# Altium schematic sheet JETSON.SchDoc
size E; SheetNumber: 4; SheetTotal: 10
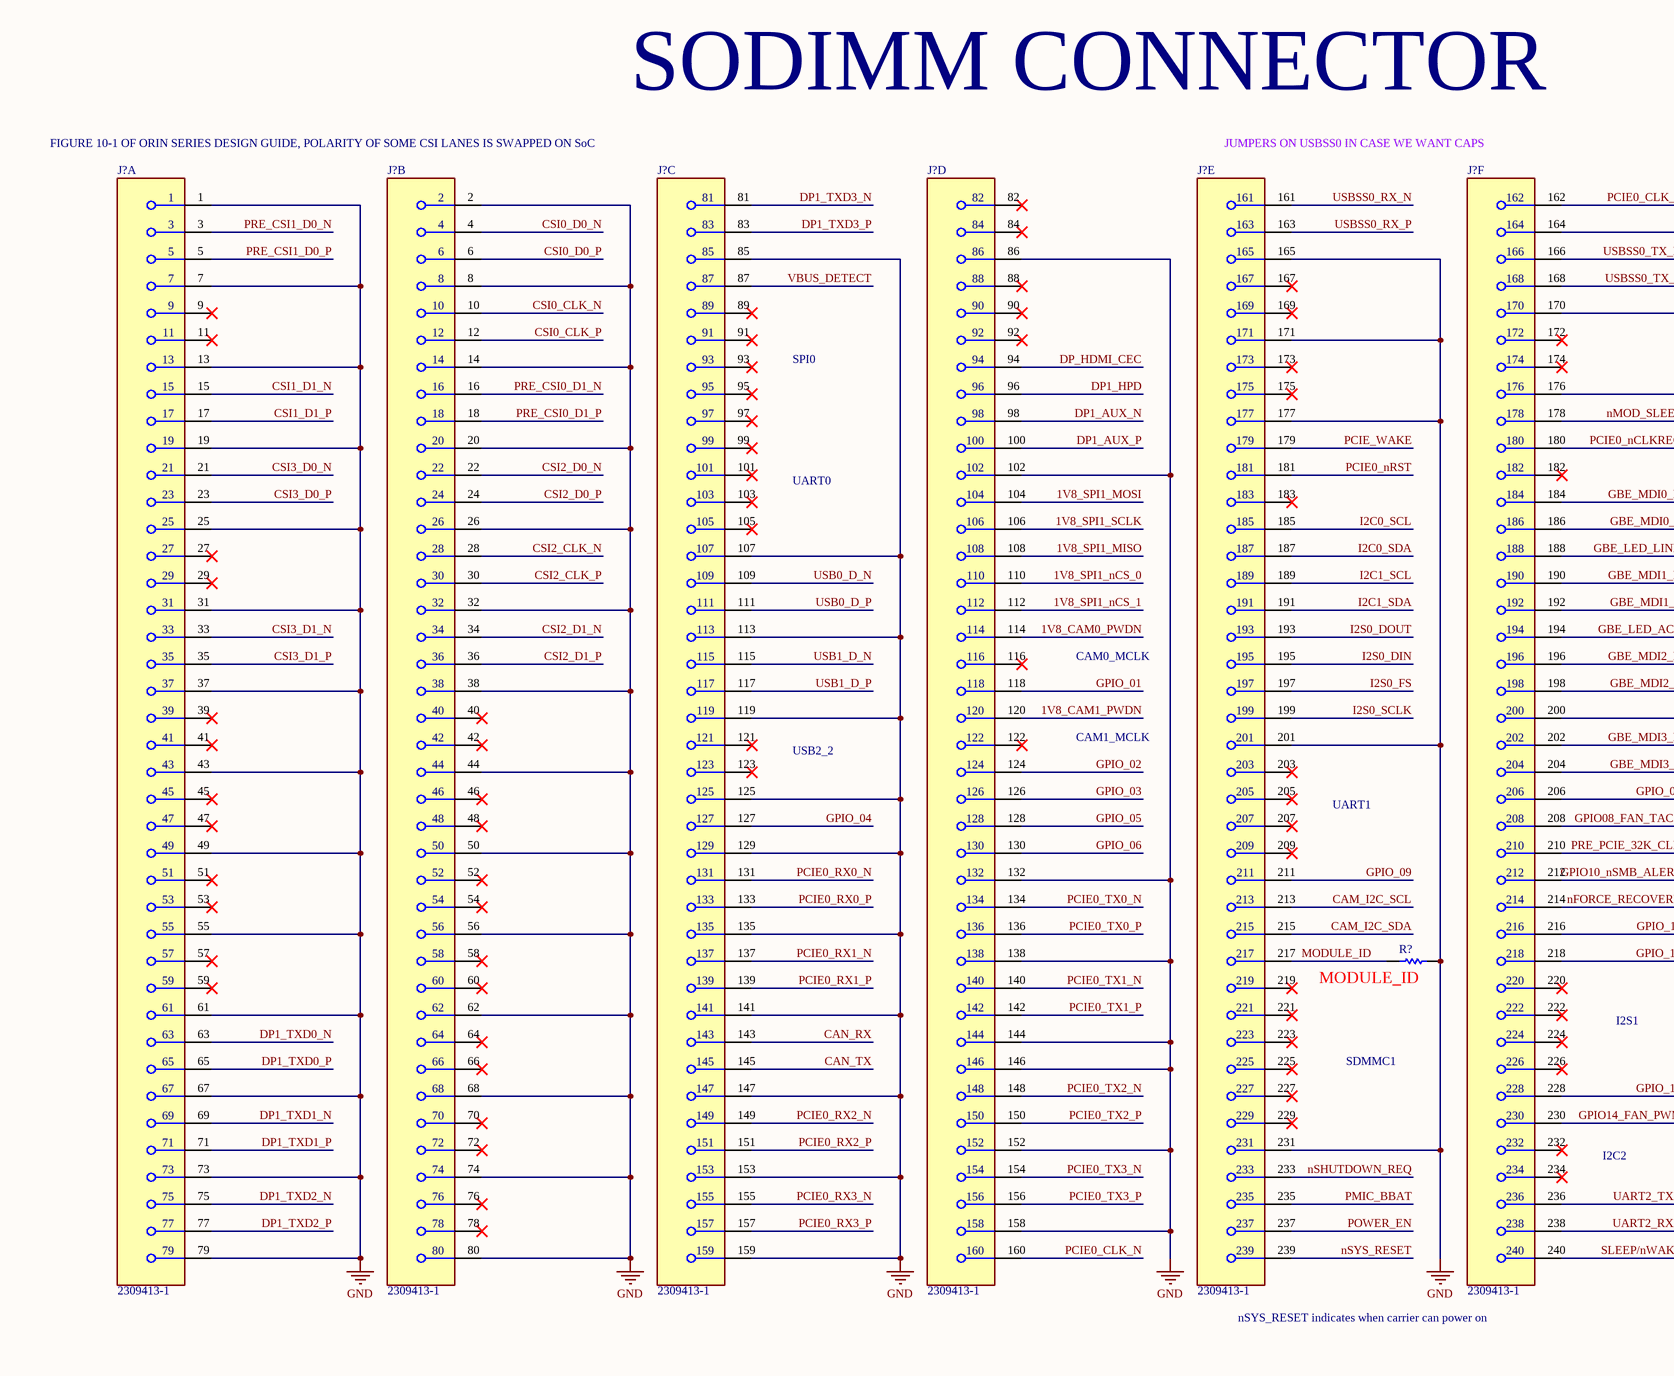
[diagram p0: JETSON.SchDoc, top left]
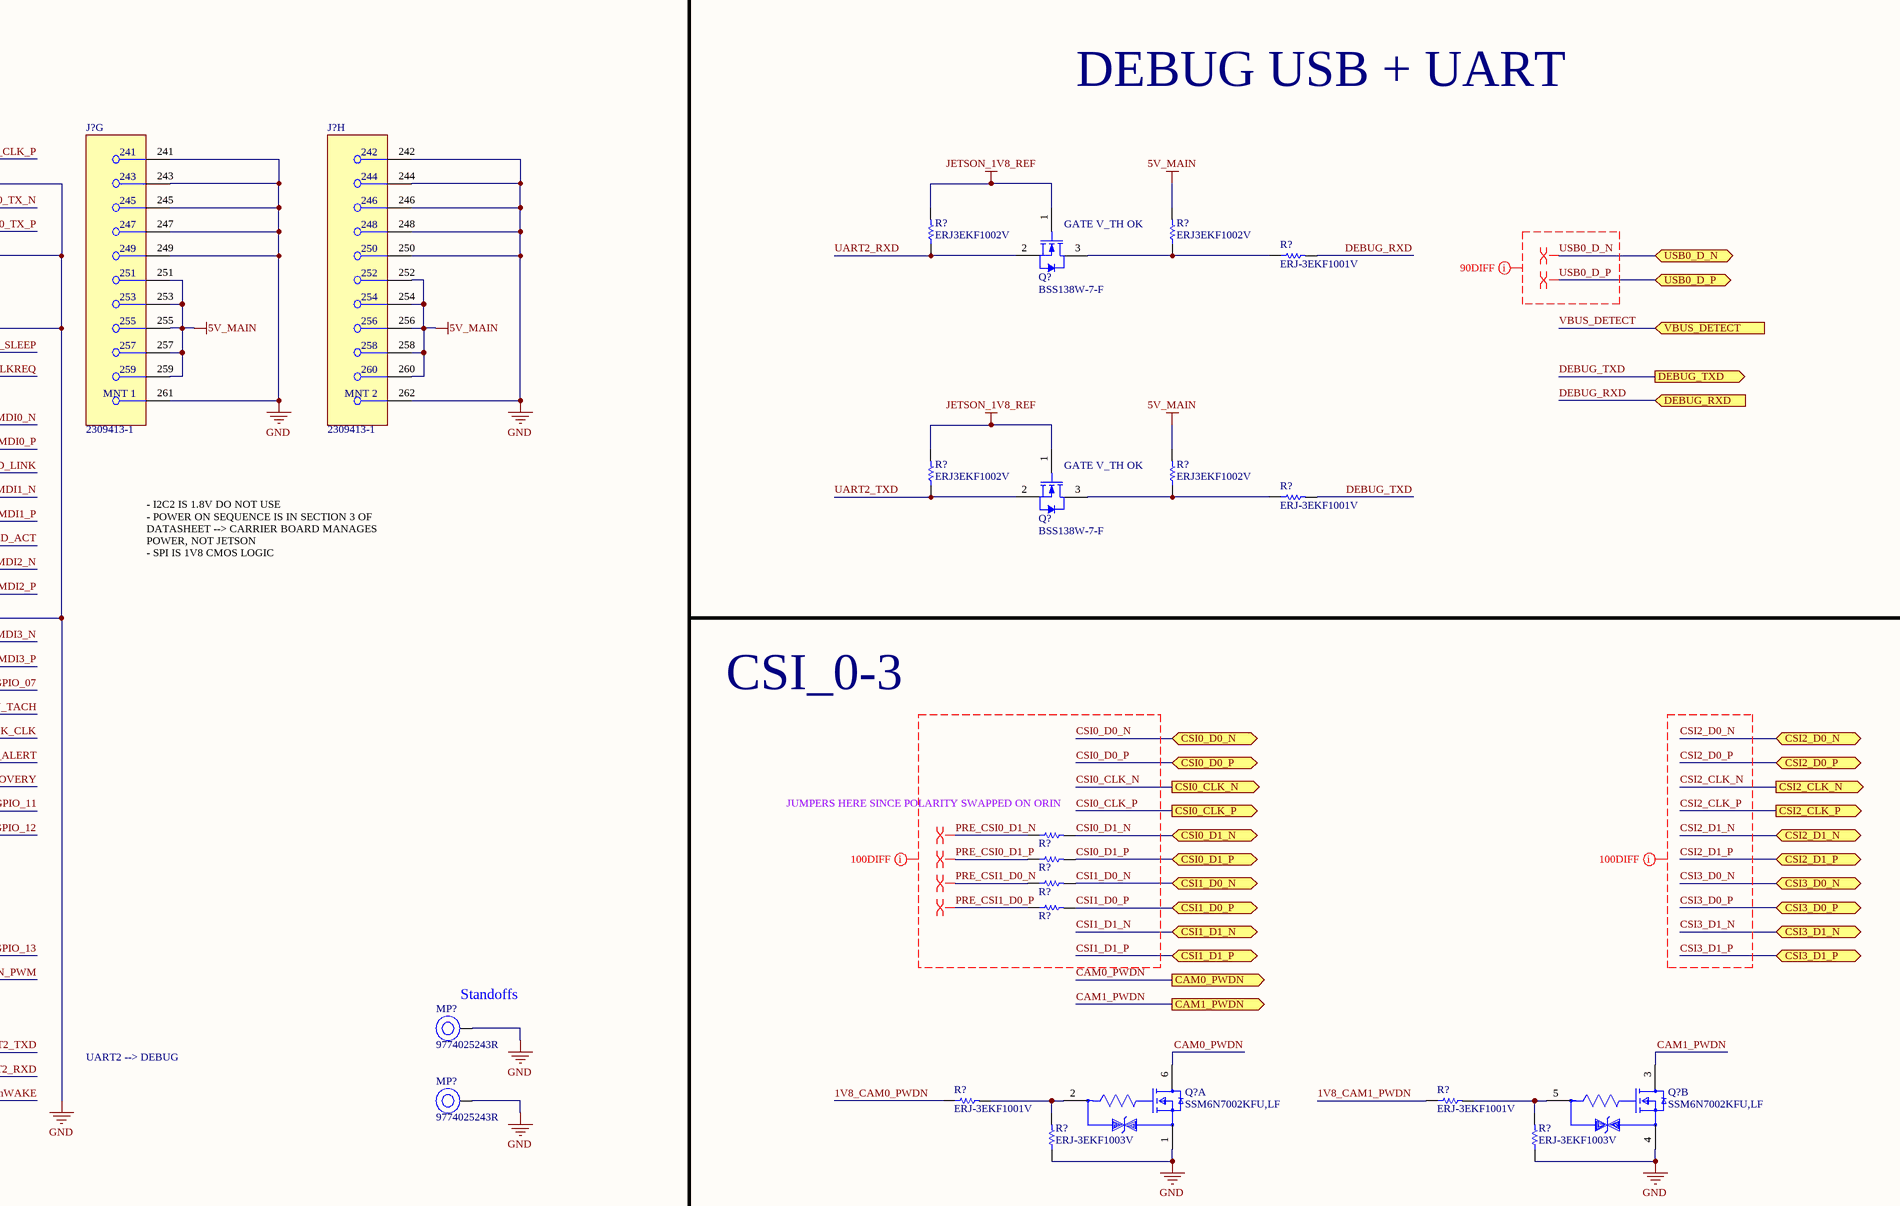
[diagram p1: JETSON.SchDoc, top middle]
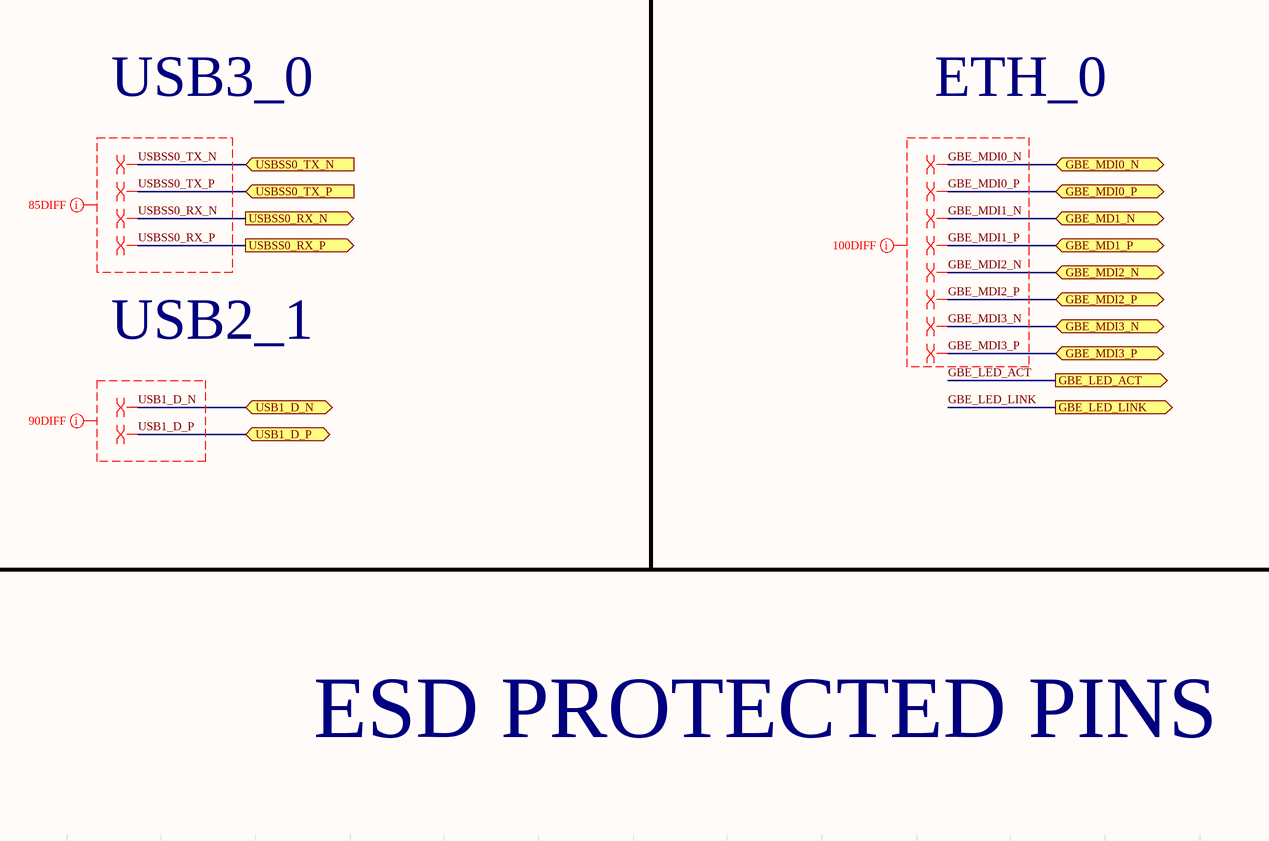
[diagram p2: JETSON.SchDoc, top right]
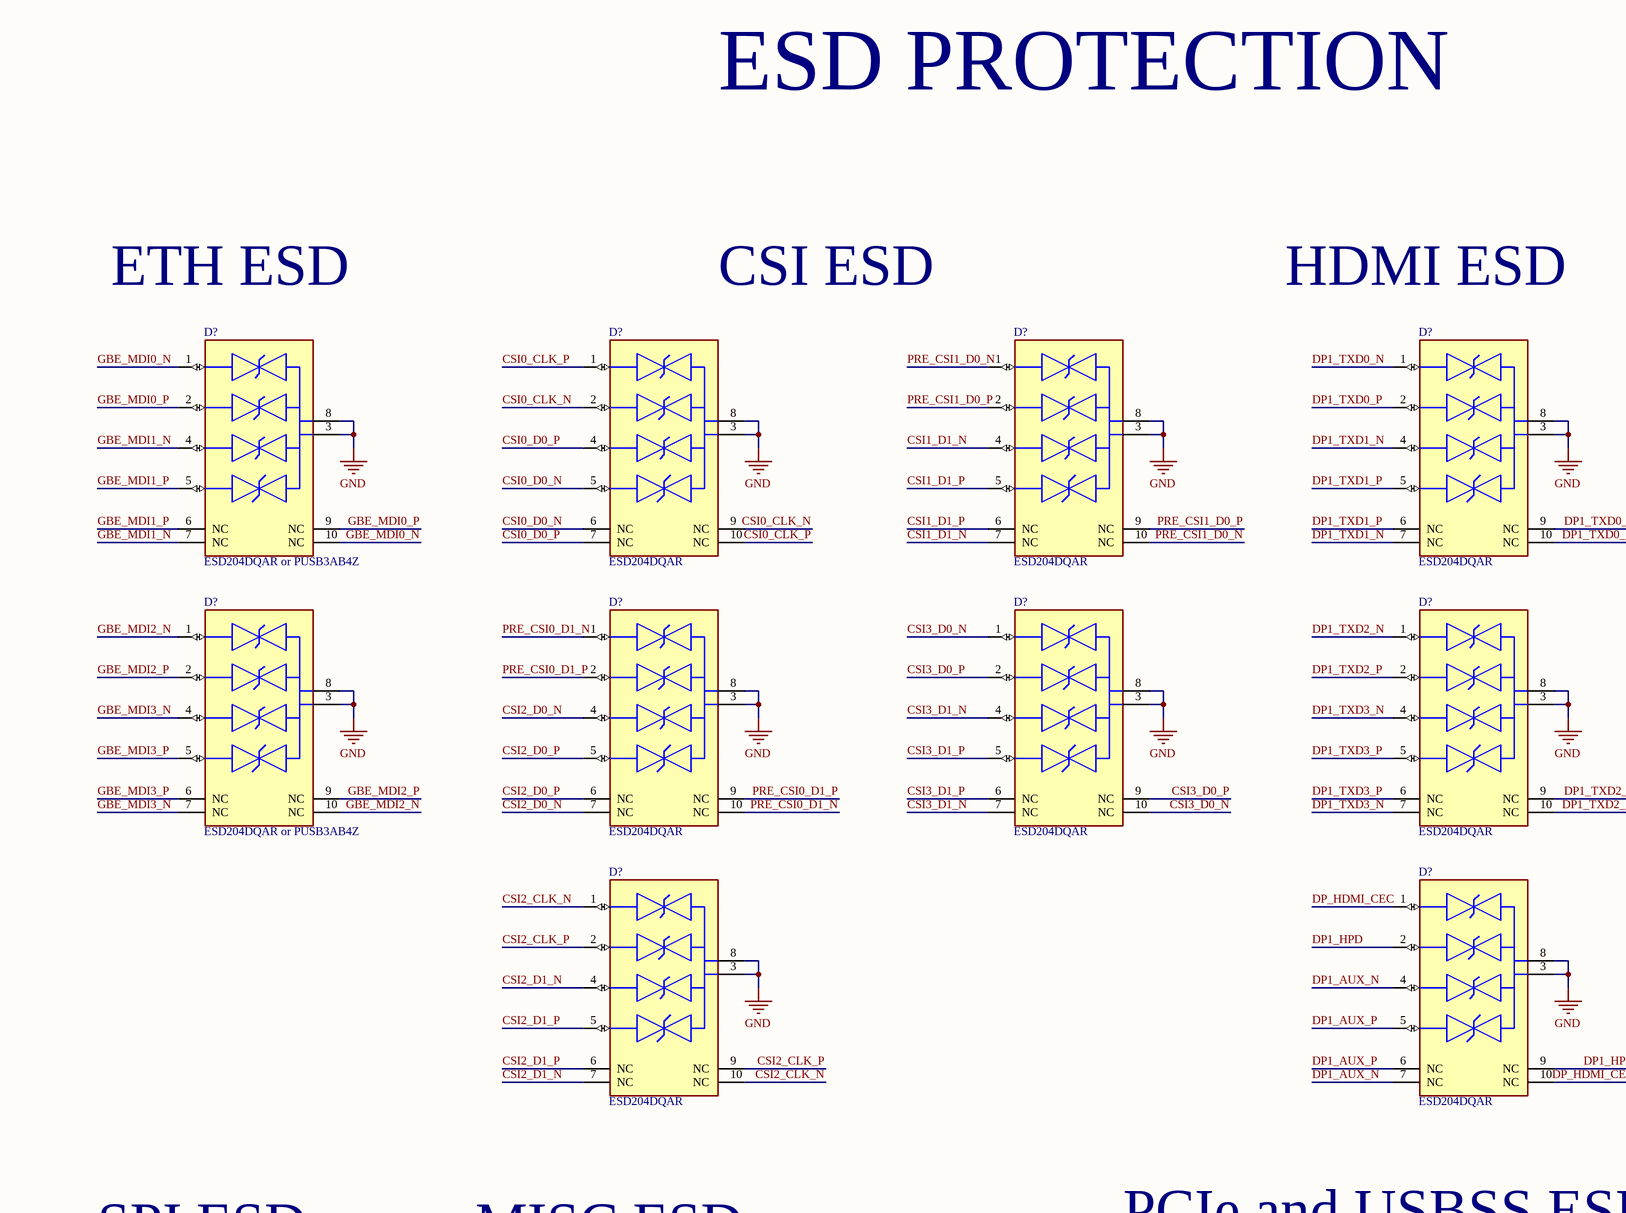
[diagram p3: JETSON.SchDoc, centre left]
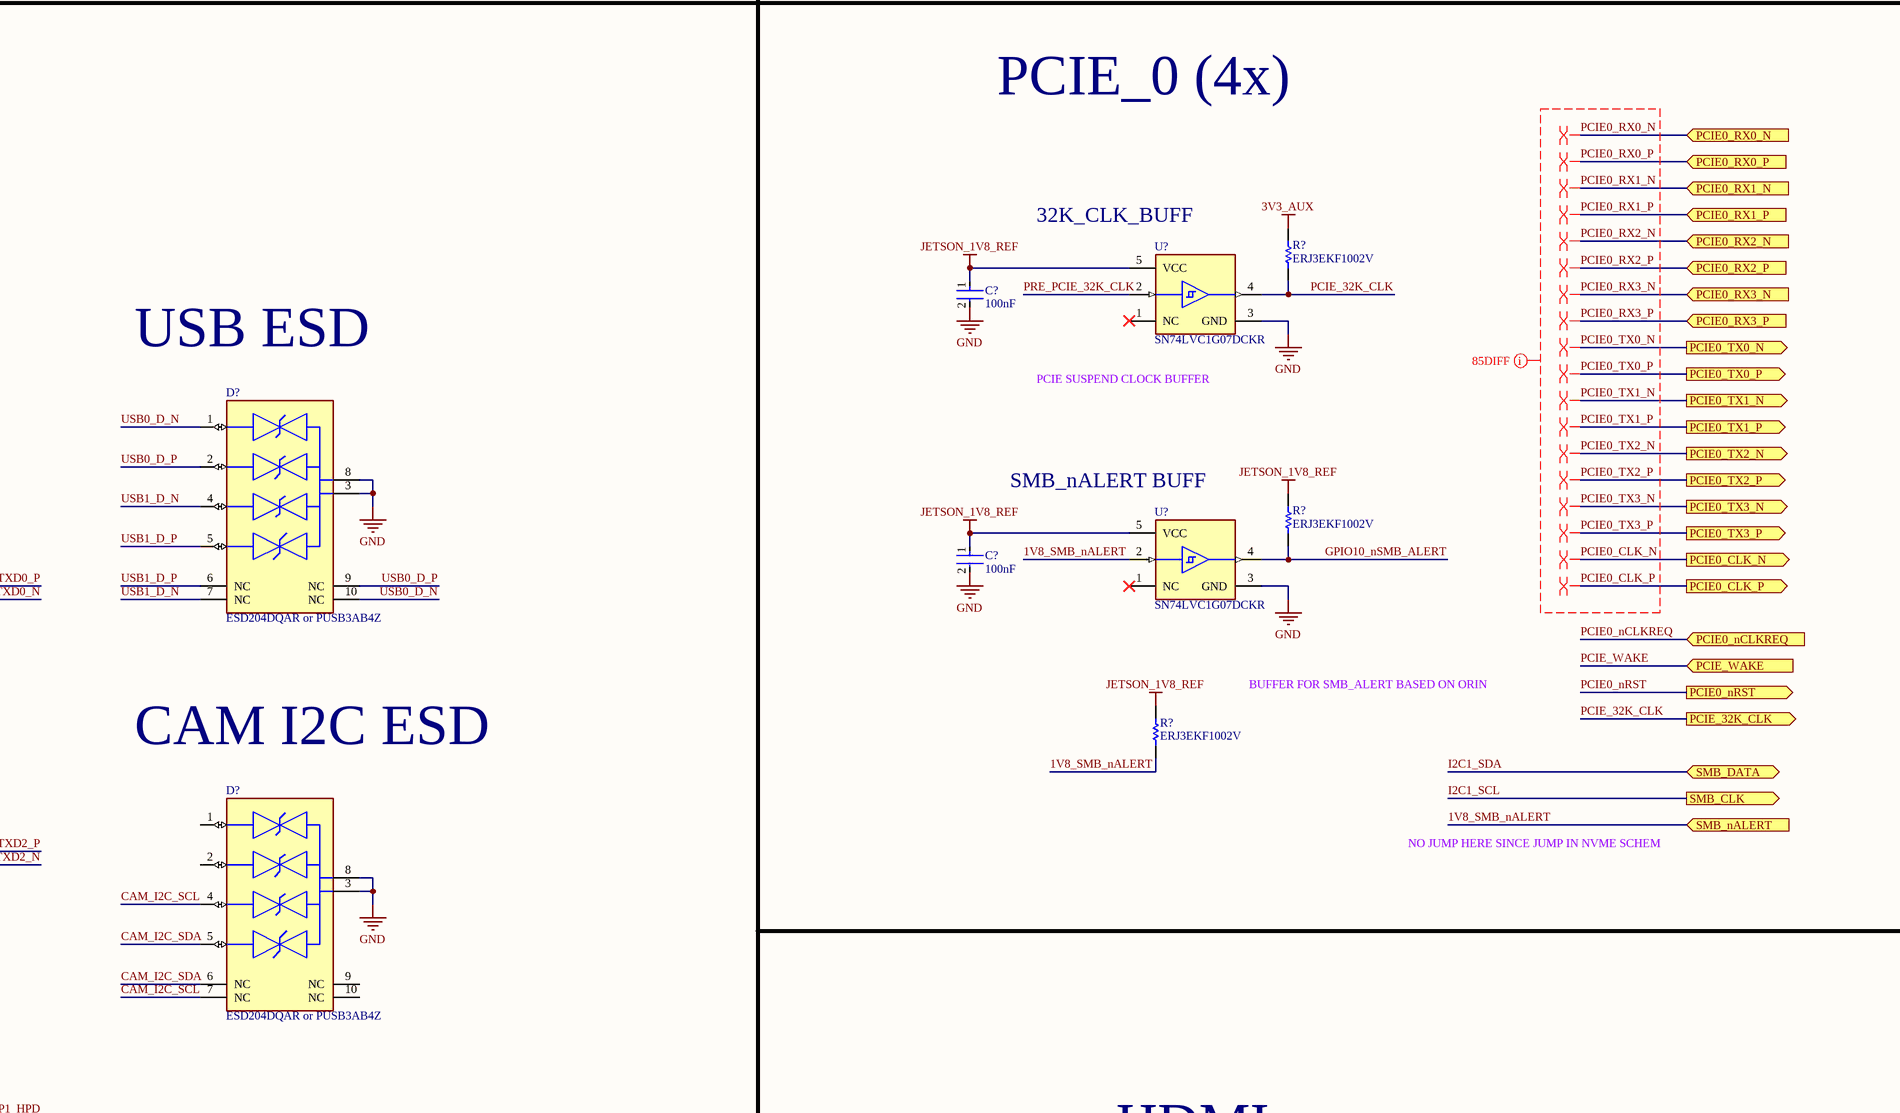
[diagram p4: JETSON.SchDoc, centre middle]
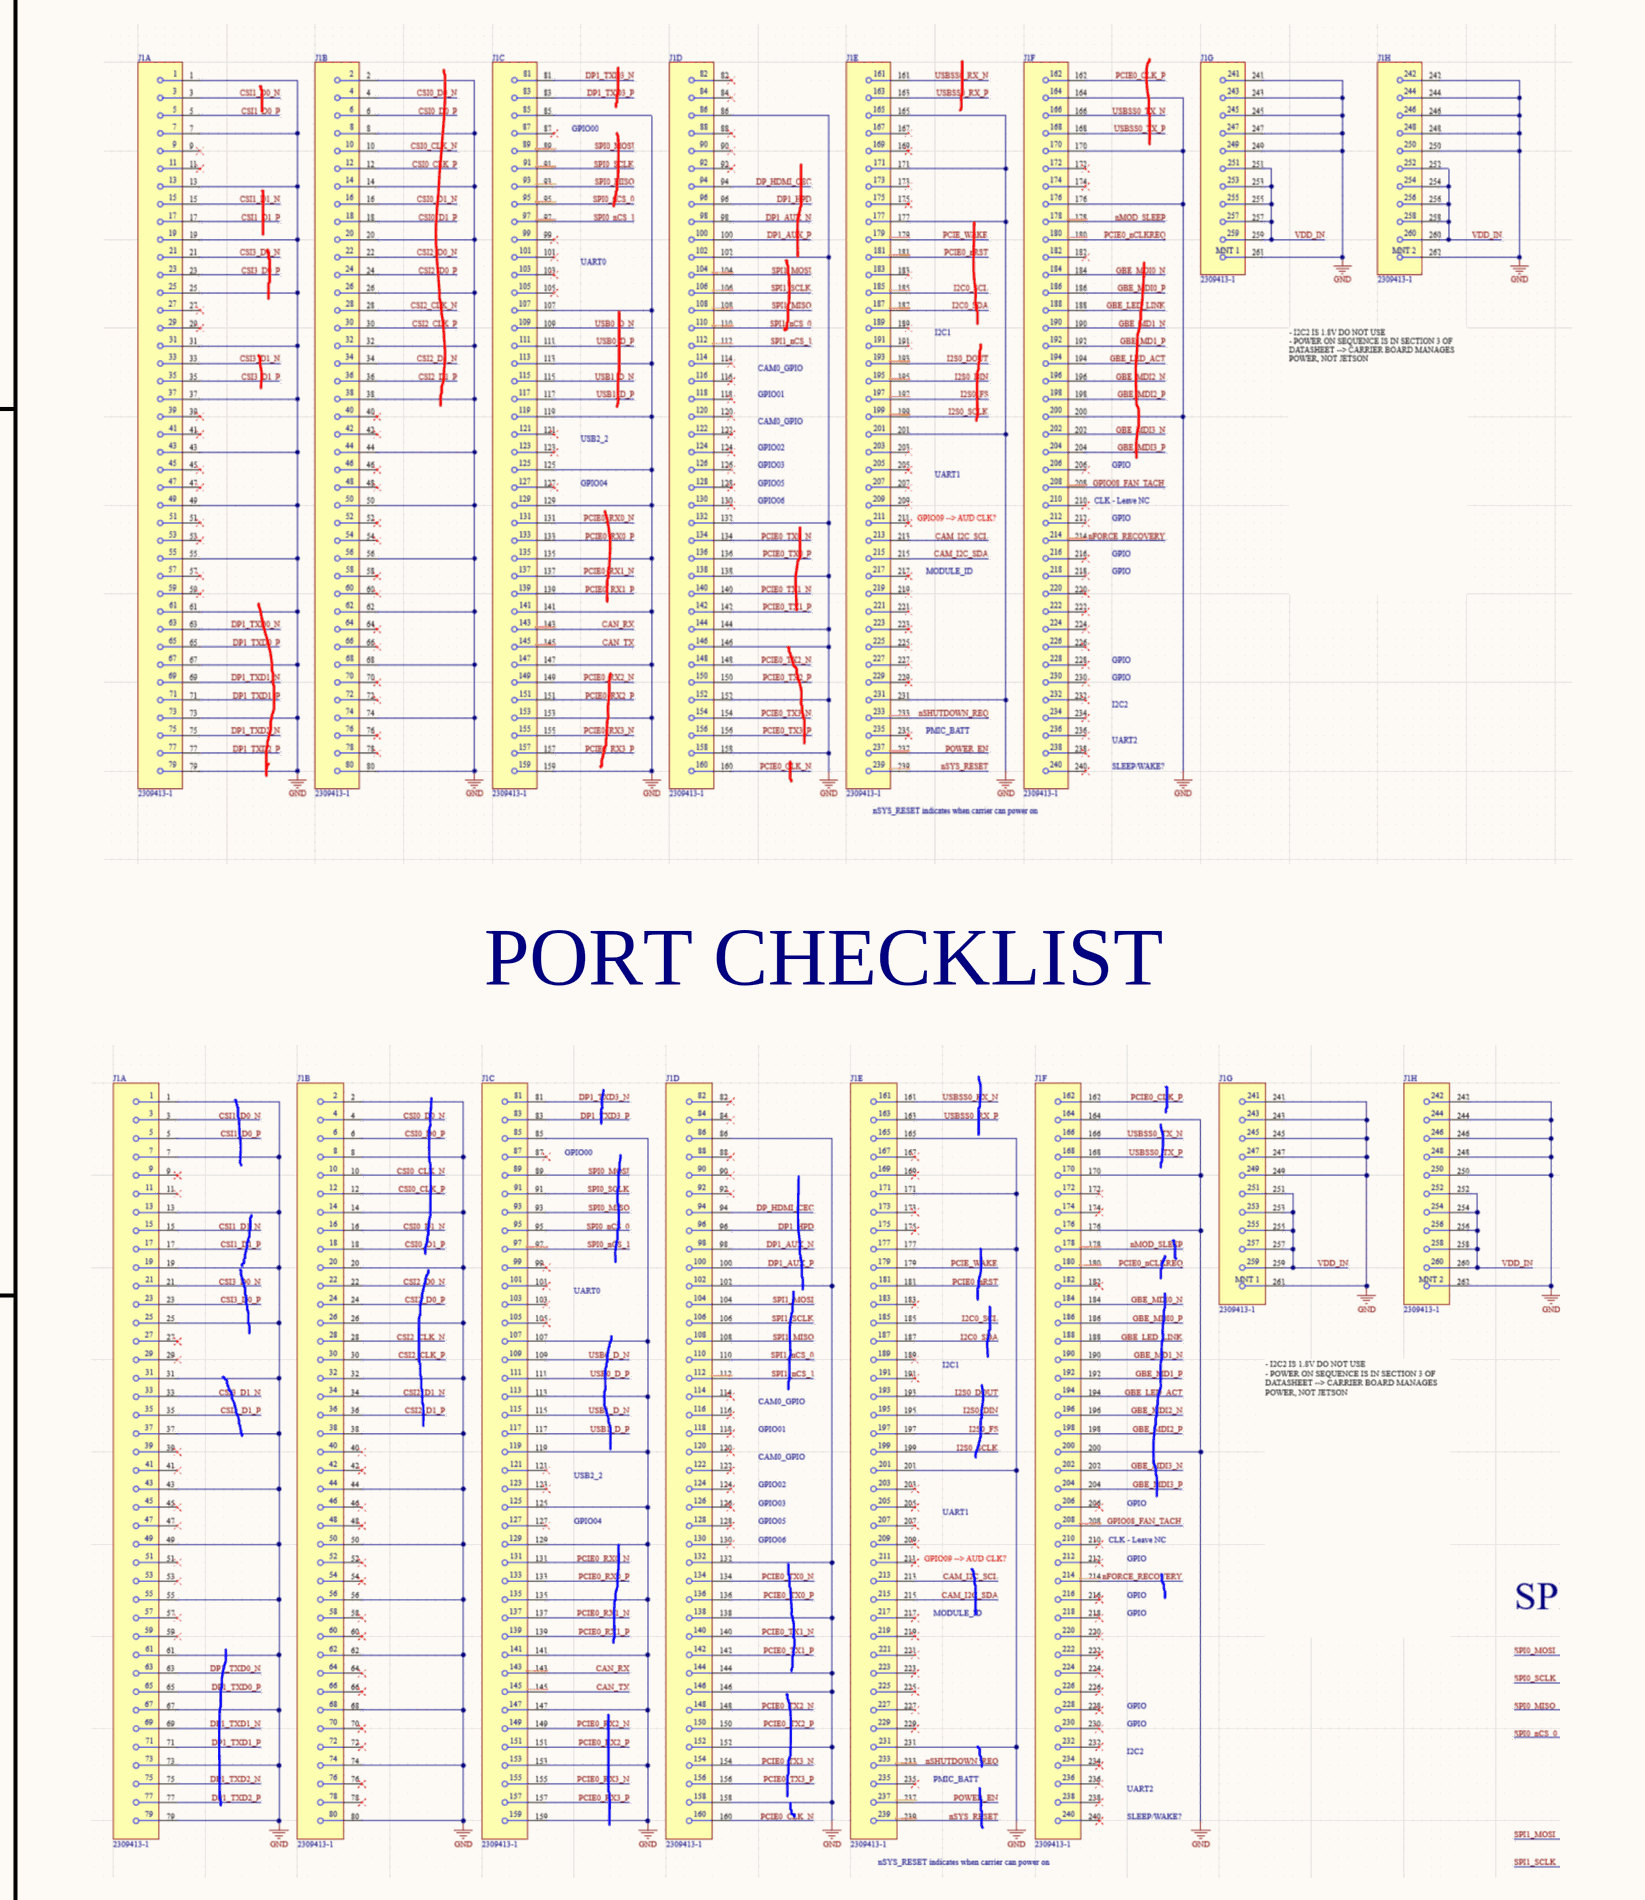
[diagram p5: JETSON.SchDoc, centre right]
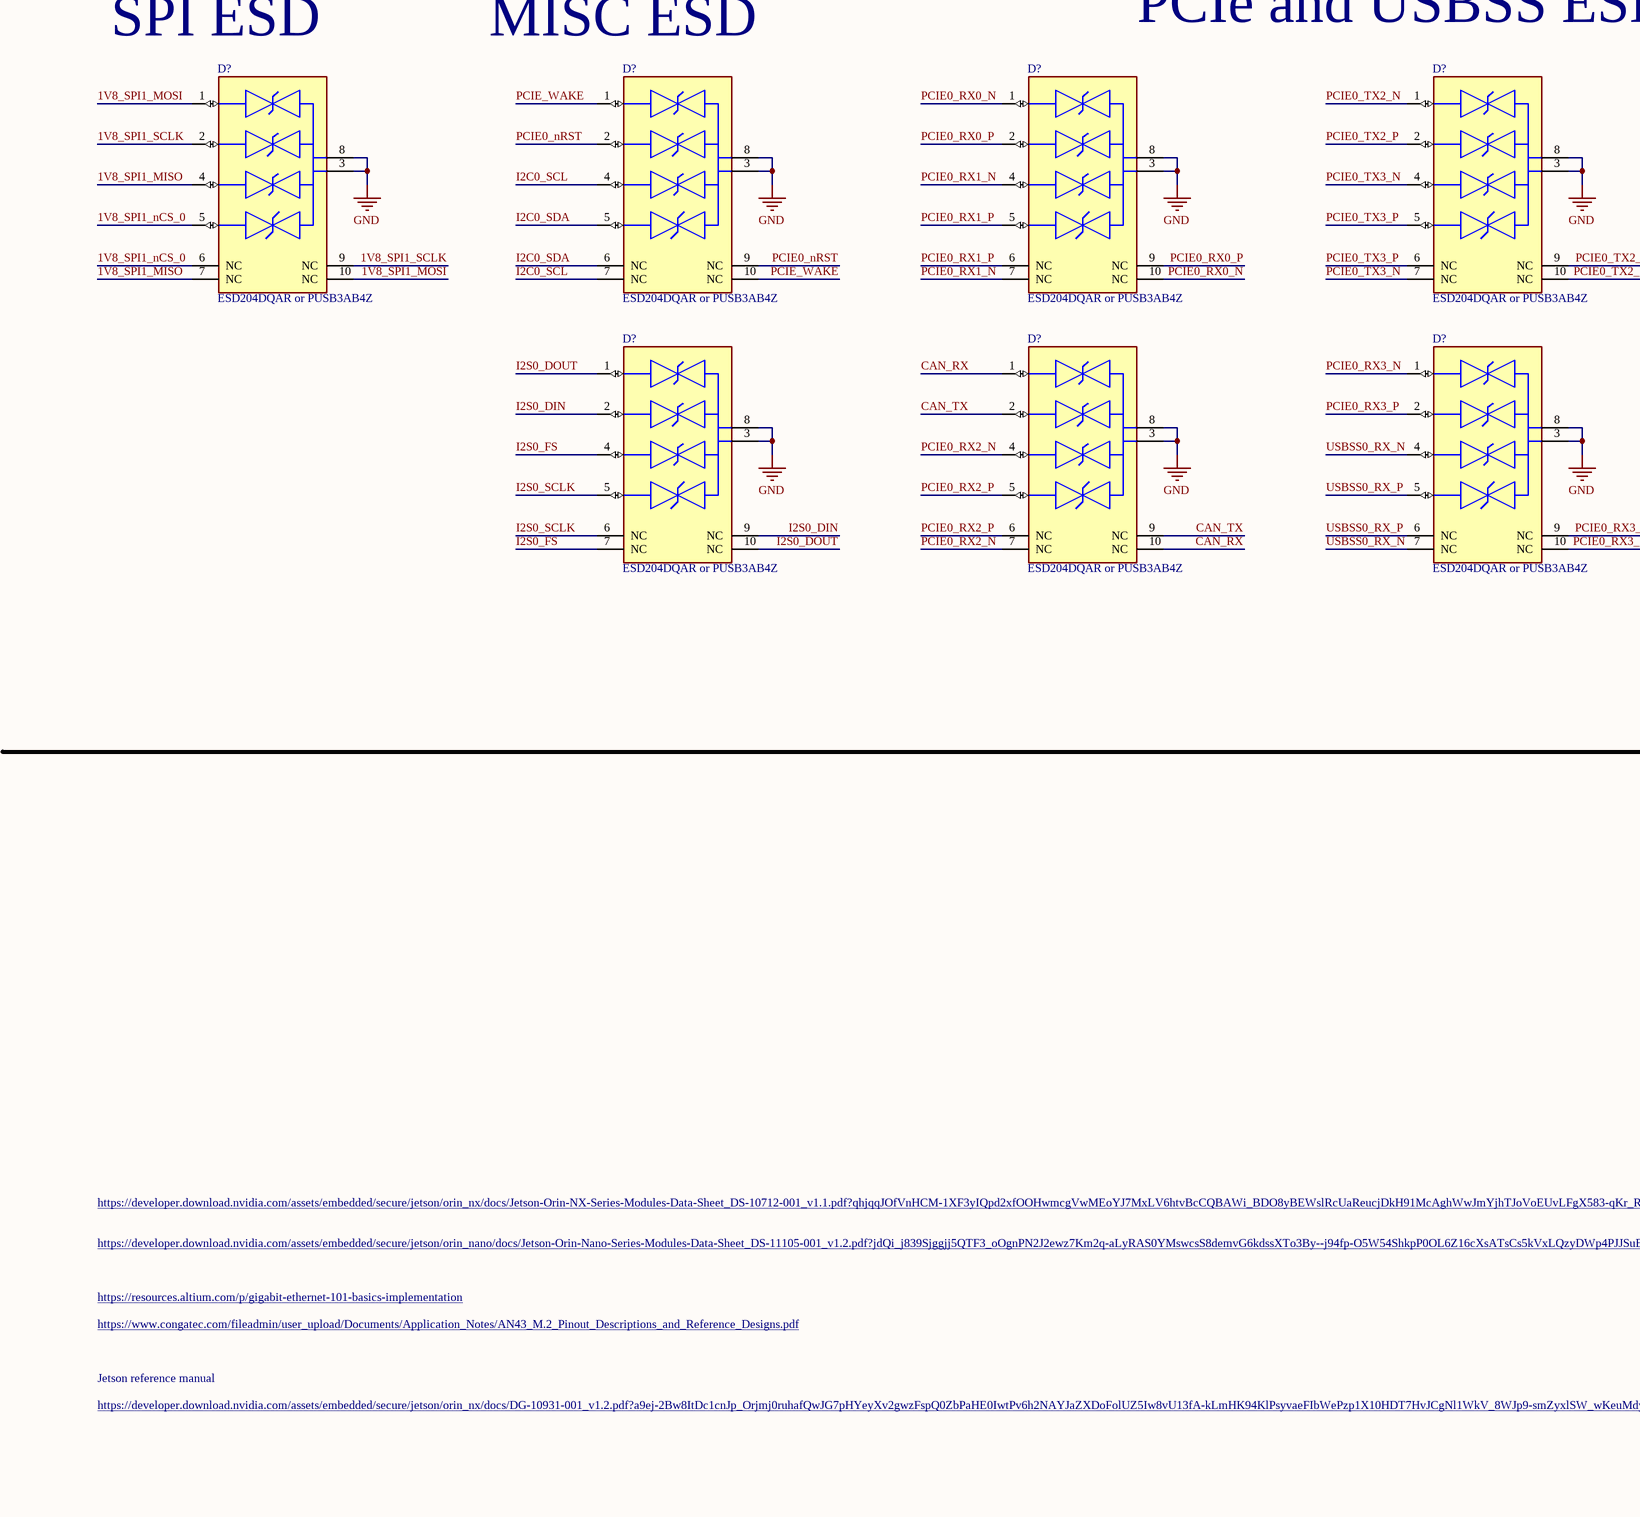
[diagram p6: JETSON.SchDoc, bottom left]
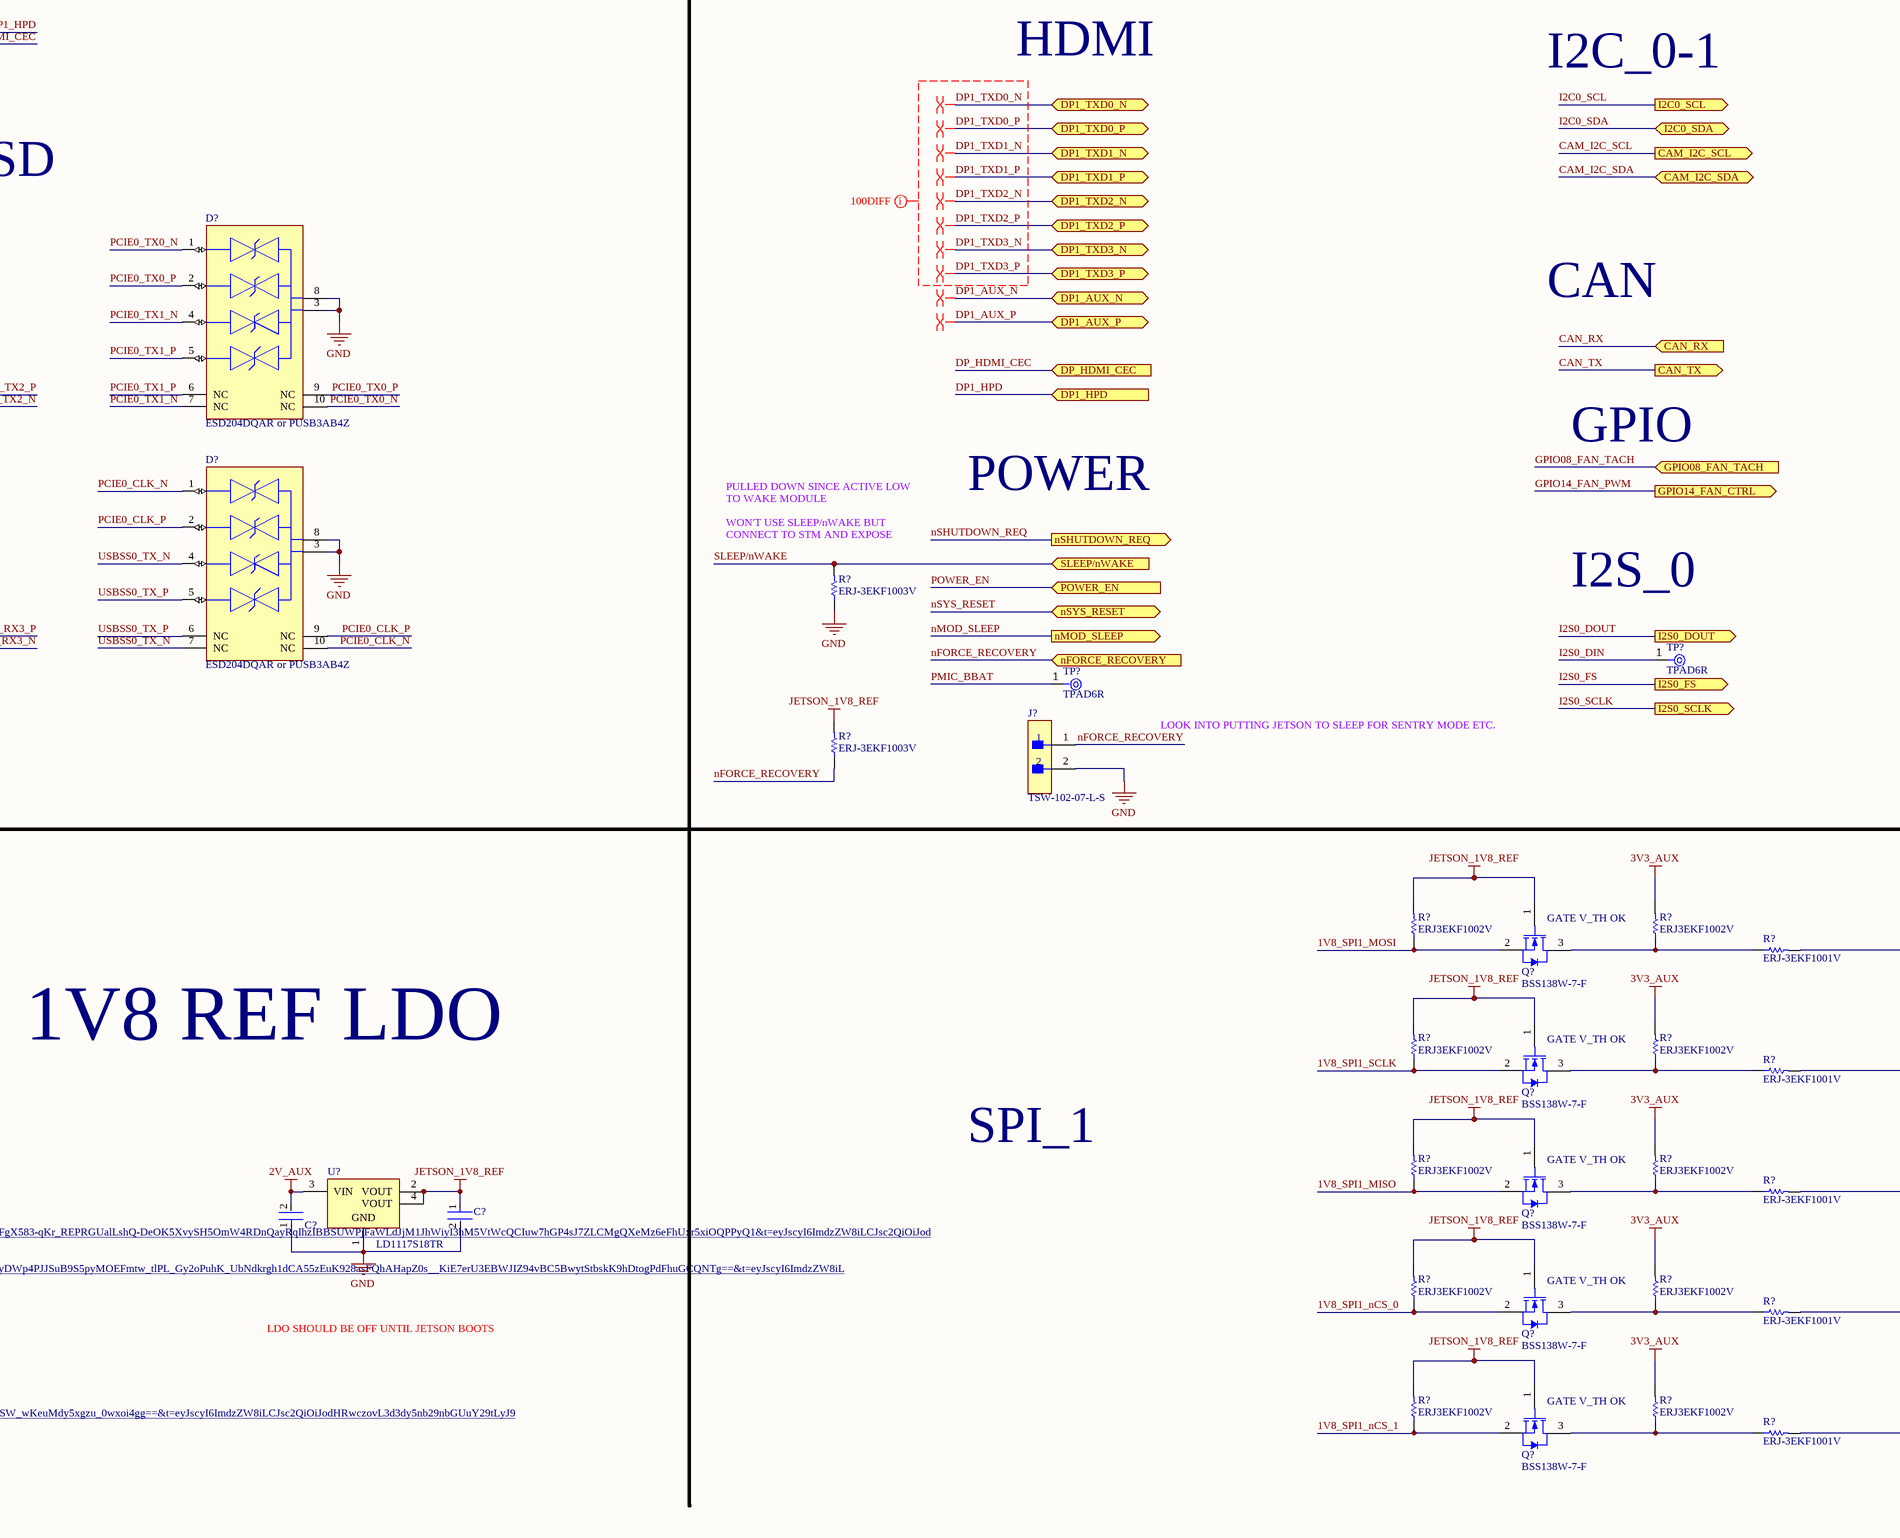
[diagram p7: JETSON.SchDoc, bottom middle]
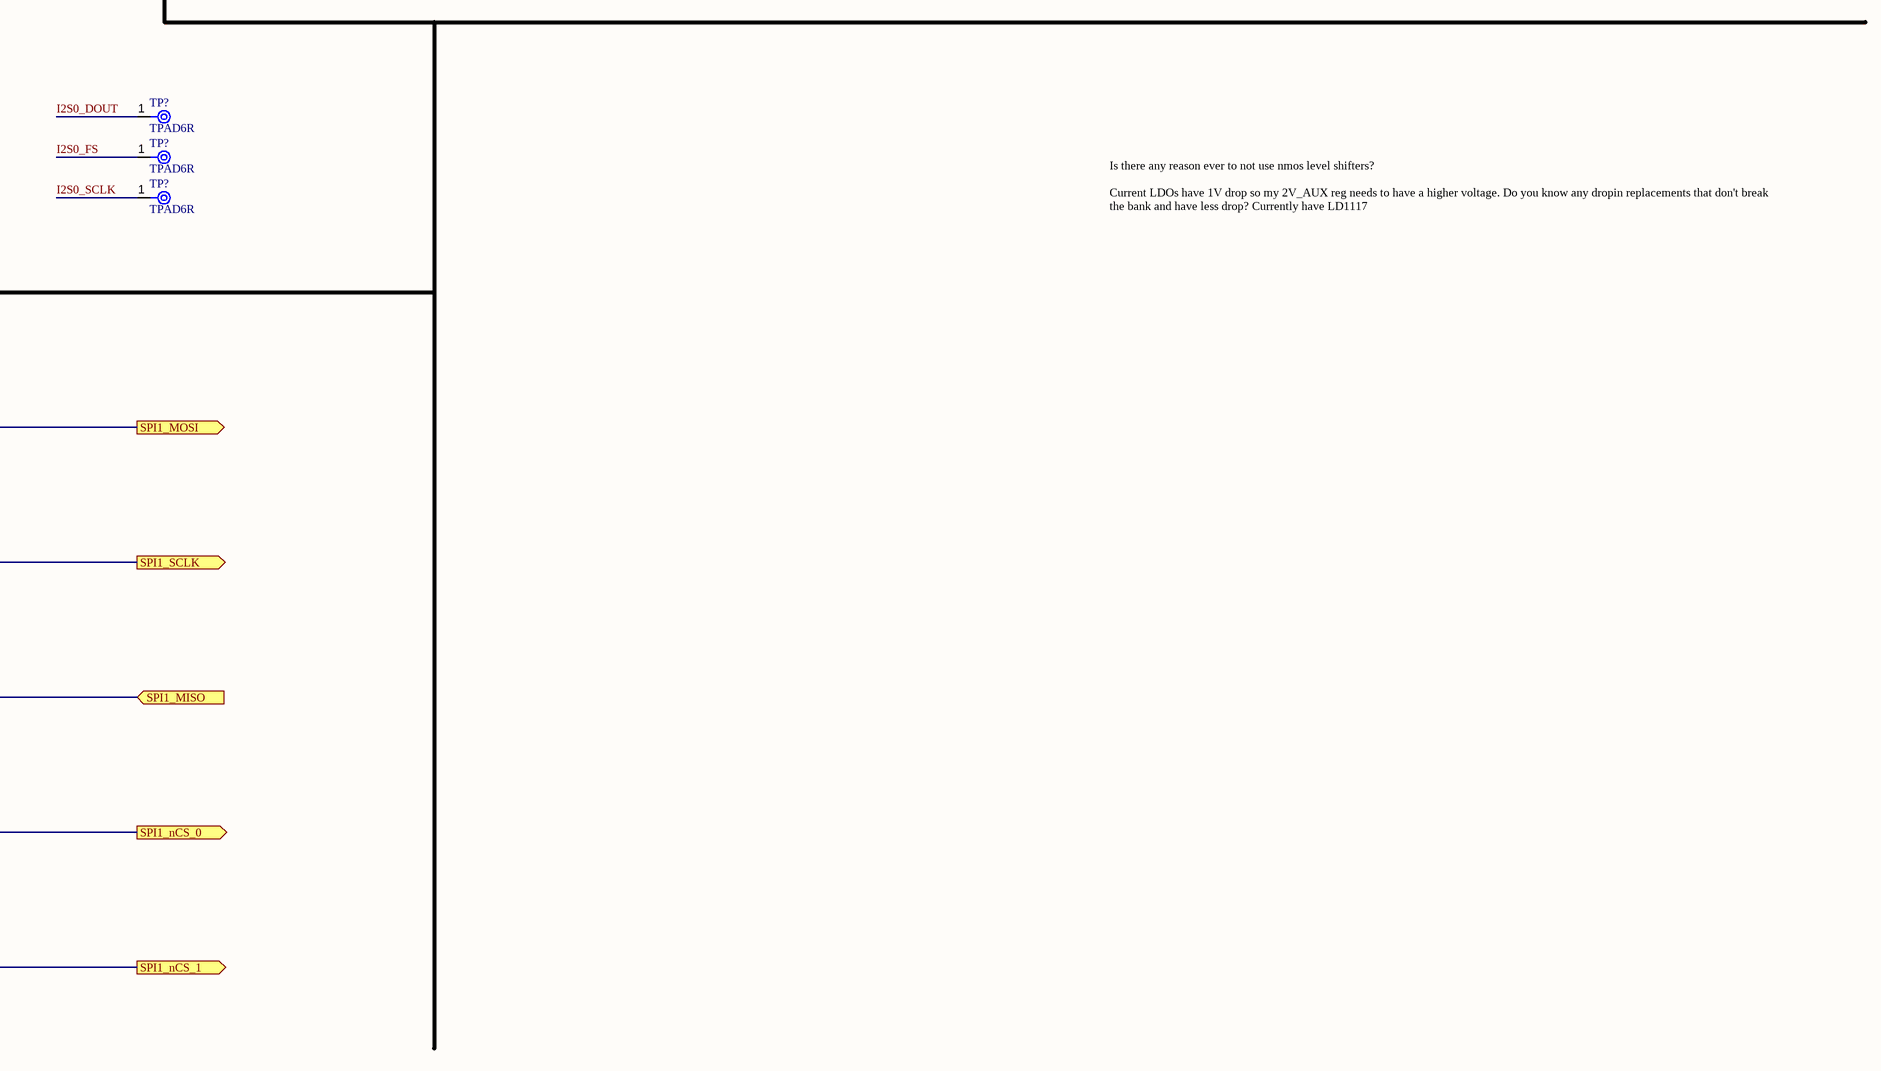
[diagram p8: JETSON.SchDoc, bottom right]

## Parts
(Parts that share a designator on the sheet are numbered #1, #2 ... from top to bottom, then left to right.)
C?#1  100nF  [FP-0402-L_1_0_0_05-W_0_5-IPC_A]
C?#2  100nF  [FP-0402-L_1_0_0_05-W_0_5-IPC_A]
C?#3  GRM188R60J106ME47D  [FP-GRM188-0_1-e0_2_0_55-IPC_A]  (value not drawn)
C?#4  C1005X7R1H104K050BB  [FP-C1005-050-0_05-IPC_C]  (value not drawn)
D?#1  ESD204DQAR or PUSB3AB4Z  [FP-DQA0010A-MFG]
D?#2  ESD204DQAR  [FP-DQA0010A-MFG]
D?#3  ESD204DQAR  [FP-DQA0010A-MFG]
D?#4  ESD204DQAR  [FP-DQA0010A-MFG]
D?#5  ESD204DQAR or PUSB3AB4Z  [FP-DQA0010A-MFG]
D?#6  ESD204DQAR or PUSB3AB4Z  [FP-DQA0010A-MFG]
D?#7  ESD204DQAR  [FP-DQA0010A-MFG]
D?#8  ESD204DQAR  [FP-DQA0010A-MFG]
D?#9  ESD204DQAR  [FP-DQA0010A-MFG]
D?#10  ESD204DQAR or PUSB3AB4Z  [FP-DQA0010A-MFG]
D?#11  ESD204DQAR  [FP-DQA0010A-MFG]
D?#12  ESD204DQAR  [FP-DQA0010A-MFG]
D?#13  ESD204DQAR or PUSB3AB4Z  [FP-DQA0010A-MFG]
D?#14  ESD204DQAR or PUSB3AB4Z  [FP-DQA0010A-MFG]
D?#15  ESD204DQAR or PUSB3AB4Z  [FP-DQA0010A-MFG]
D?#16  ESD204DQAR or PUSB3AB4Z  [FP-DQA0010A-MFG]
D?#17  ESD204DQAR or PUSB3AB4Z  [FP-DQA0010A-MFG]
D?#18  ESD204DQAR or PUSB3AB4Z  [FP-DQA0010A-MFG]
D?#19  ESD204DQAR or PUSB3AB4Z  [FP-DQA0010A-MFG]
D?#20  ESD204DQAR or PUSB3AB4Z  [FP-DQA0010A-MFG]
D?#21  ESD204DQAR or PUSB3AB4Z  [FP-DQA0010A-MFG]
J?#1  2309413-1  [FP-2309413-1-MFG]  (part A of 8)
J?#2  2309413-1  [FP-2309413-1-MFG]  (part B of 8)
J?#3  2309413-1  [FP-2309413-1-MFG]  (part C of 8)
J?#4  2309413-1  [FP-2309413-1-MFG]  (part D of 8)
J?#5  2309413-1  [FP-2309413-1-MFG]  (part E of 8)
J?#6  2309413-1  [FP-2309413-1-MFG]  (part F of 8)
J?#7  2309413-1  [FP-2309413-1-MFG]  (part G of 8)
J?#8  2309413-1  [FP-2309413-1-MFG]  (part H of 8)
J?#9  TSW-102-07-L-S  [FP-TSW-102-07-L-S-MFG]
MP?#1  9774025243R  [9774025243]
MP?#2  9774025243R  [9774025243]
Q?#1  BSS138W-7-F  [DIOD-SOT323-3_V]
Q?#2  BSS138W-7-F  [DIOD-SOT323-3_V]
Q?#3  SSM6N7002KFU,LF  [FP-SSOP6-P-0_65A-MFG]  (part A of 2)
Q?#4  SSM6N7002KFU,LF  [FP-SSOP6-P-0_65A-MFG]  (part B of 2)
Q?#5  BSS138W-7-F  [DIOD-SOT323-3_V]
Q?#6  BSS138W-7-F  [DIOD-SOT323-3_V]
Q?#7  BSS138W-7-F  [DIOD-SOT323-3_V]
Q?#8  BSS138W-7-F  [DIOD-SOT323-3_V]
Q?#9  BSS138W-7-F  [DIOD-SOT323-3_V]
R?#1  ERJ3EKF1002V  [RESC1609X55X30LL15T15]
R?#2  ERJ3EKF1002V  [RESC1609X55X30LL15T15]
R?#3  ERJ-3EKF1001V  [RESC1608X55X30LL15T15]
R?#4  ERJ3EKF1002V  [RESC1609X55X30LL15T15]
R?#5  ERJ3EKF1002V  [RESC1609X55X30LL15T15]
R?#6  ERJ-3EKF1001V  [RESC1608X55X30LL15T15]
R?#7  0402 JUMPER  [RESC1005X40X25ML05T05]  (value not drawn)
R?#8  0402 JUMPER  [RESC1005X40X25ML05T05]  (value not drawn)
R?#9  0402 JUMPER  [RESC1005X40X25ML05T05]  (value not drawn)
R?#10  0402 JUMPER  [RESC1005X40X25ML05T05]  (value not drawn)
R?#11  0402 JUMPER  [RESC1005X40X25ML05T05]  (value not drawn)
R?#12  ERJ-3EKF1001V  [RESC1608X55X30LL15T15]
R?#13  ERJ-3EKF1001V  [RESC1608X55X30LL15T15]
R?#14  ERJ-3EKF1003V  [RESC1608X55X30ML15T15]
R?#15  ERJ-3EKF1003V  [RESC1608X55X30ML15T15]
R?#16  ERJ3EKF1002V  [RESC1609X55X30LL15T15]
R?#17  ERJ3EKF1002V  [RESC1609X55X30LL15T15]
R?#18  ERJ3EKF1002V  [RESC1609X55X30LL15T15]
R?#19  ERJ-3EKF1003V  [RESC1608X55X30ML15T15]
R?#20  ERJ-3EKF1003V  [RESC1608X55X30ML15T15]
R?#21  ERJ3EKF1002V  [RESC1609X55X30LL15T15]
R?#22  ERJ3EKF1002V  [RESC1609X55X30LL15T15]
R?#23  ERJ-3EKF1001V  [RESC1608X55X30LL15T15]
R?#24  ERJ3EKF1002V  [RESC1609X55X30LL15T15]
R?#25  ERJ3EKF1002V  [RESC1609X55X30LL15T15]
R?#26  ERJ-3EKF1001V  [RESC1608X55X30LL15T15]
R?#27  ERJ3EKF1002V  [RESC1609X55X30LL15T15]
R?#28  ERJ3EKF1002V  [RESC1609X55X30LL15T15]
R?#29  ERJ-3EKF1001V  [RESC1608X55X30LL15T15]
R?#30  ERJ3EKF1002V  [RESC1609X55X30LL15T15]
R?#31  ERJ3EKF1002V  [RESC1609X55X30LL15T15]
R?#32  ERJ-3EKF1001V  [RESC1608X55X30LL15T15]
R?#33  ERJ3EKF1002V  [RESC1609X55X30LL15T15]
R?#34  ERJ3EKF1002V  [RESC1609X55X30LL15T15]
R?#35  ERJ-3EKF1001V  [RESC1608X55X30LL15T15]
TP?#1  TPAD6R  [New footprint 1]
TP?#2  TPAD6R  [New footprint 1]
TP?#3  TPAD6R  [New footprint 1]
TP?#4  TPAD6R  [New footprint 1]
TP?#5  TPAD6R  [New footprint 1]
U?#1  SN74LVC1G07DCKR  [FP-DCK0005A-IPC_C]
U?#2  SN74LVC1G07DCKR  [FP-DCK0005A-IPC_C]
U?#3  LD1117S18TR  [SOT-223_M]

## Ports
CAM0_PWDN (out), CAM1_PWDN (out), CAM_I2C_SCL (out), CAM_I2C_SDA (bidir), CAN_RX (in), CAN_TX (out), CSI0_CLK_N (out), CSI0_CLK_P (out), CSI0_D0_N (bidir), CSI0_D0_P (bidir), CSI0_D1_N (bidir), CSI0_D1_P (bidir), CSI1_D0_N (bidir), CSI1_D0_P (bidir), CSI1_D1_N (bidir), CSI1_D1_P (bidir), CSI2_CLK_N (out), CSI2_CLK_P (out), CSI2_D0_N (bidir), CSI2_D0_P (bidir), CSI2_D1_N (bidir), CSI2_D1_P (bidir), CSI3_D0_N (bidir), CSI3_D0_P (bidir), CSI3_D1_N (bidir), CSI3_D1_P (bidir), DEBUG_RXD (in), DEBUG_TXD (out), DP1_AUX_N (bidir), DP1_AUX_P (bidir), DP1_HPD (in), DP1_TXD0_N (bidir), DP1_TXD0_P (bidir), DP1_TXD1_N (bidir), DP1_TXD1_P (bidir), DP1_TXD2_N (bidir), DP1_TXD2_P (bidir), DP1_TXD3_N (bidir), DP1_TXD3_P (bidir), DP_HDMI_CEC (in), GBE_LED_ACT (out), GBE_LED_LINK (out), GBE_MD1_N (bidir), GBE_MD1_P (bidir), GBE_MDI0_N (bidir), GBE_MDI0_P (bidir), GBE_MDI2_N (bidir), GBE_MDI2_P (bidir), GBE_MDI3_N (bidir), GBE_MDI3_P (bidir), GPIO08_FAN_TACH (in), GPIO14_FAN_CTRL (out), I2C0_SCL (out), I2C0_SDA (bidir), I2S0_DOUT (out), I2S0_FS (out), I2S0_SCLK (out), nFORCE_RECOVERY (in), nMOD_SLEEP (out), nSHUTDOWN_REQ (out), nSYS_RESET (bidir), PCIE0_CLK_N (out), PCIE0_CLK_P (out), PCIE0_nCLKREQ (in), PCIE0_nRST (out), PCIE0_RX0_N (in), PCIE0_RX0_P (in), PCIE0_RX1_N (in), PCIE0_RX1_P (in), PCIE0_RX2_N (in), PCIE0_RX2_P (in), PCIE0_RX3_N (in), PCIE0_RX3_P (in), PCIE0_TX0_N (out), PCIE0_TX0_P (out), PCIE0_TX1_N (out), PCIE0_TX1_P (out), PCIE0_TX2_N (out), PCIE0_TX2_P (out), PCIE0_TX3_N (out), PCIE0_TX3_P (out), PCIE_32K_CLK (out), PCIE_WAKE (in), POWER_EN (in), SLEEP/nWAKE (in), SMB_CLK (out), SMB_DATA (bidir), SMB_nALERT (in), SPI1_MISO (in), SPI1_MOSI (out), SPI1_nCS_0 (out), SPI1_nCS_1 (out), SPI1_SCLK (out), USB0_D_N (bidir), USB0_D_P (bidir), USB1_D_N (bidir), USB1_D_P (bidir), USBSS0_RX_N (out), USBSS0_RX_P (out), USBSS0_TX_N (in), USBSS0_TX_P (in), VBUS_DETECT (in)

## Nets
2V_AUX: C?#4.2 U?#3.3(VIN)
3V3_AUX: R?#16.2 R?#22.2 R?#25.2 R?#28.2 R?#31.2 R?#34.2
5V_MAIN: J?#7.251 J?#7.253 J?#7.255 J?#7.257 J?#7.259 J?#8.252 J?#8.254 J?#8.256 J?#8.258 J?#8.260 R?#2.2 R?#5.2
GND: C?#1.2 C?#2.2 C?#3.2 C?#4.1 D?#1.3(GND) D?#1.8(GND) D?#2.3(GND) D?#2.8(GND) D?#3.3(GND) D?#3.8(GND) D?#4.3(GND) D?#4.8(GND) D?#5.3(GND) D?#5.8(GND) D?#6.3(GND) D?#6.8(GND) D?#7.3(GND) D?#7.8(GND) D?#8.3(GND) D?#8.8(GND) D?#9.3(GND) D?#9.8(GND) D?#10.3(GND) D?#10.8(GND) D?#11.3(GND) D?#11.8(GND) D?#12.3(GND) D?#12.8(GND) D?#13.3(GND) D?#13.8(GND) D?#14.3(GND) D?#14.8(GND) D?#15.3(GND) D?#15.8(GND) D?#16.3(GND) D?#16.8(GND) D?#17.3(GND) D?#17.8(GND) D?#18.3(GND) D?#18.8(GND) D?#19.3(GND) D?#19.8(GND) D?#20.3(GND) D?#20.8(GND) D?#21.3(GND) D?#21.8(GND) J?#1.1 J?#1.7 J?#1.13 J?#1.19 J?#1.25 J?#1.31 J?#1.37 J?#1.43 J?#1.49 J?#1.55 J?#1.61 J?#1.67 J?#1.73 J?#1.79 J?#2.2 J?#2.8 J?#2.14 J?#2.20 J?#2.26 J?#2.32 J?#2.38 J?#2.44 J?#2.50 J?#2.56 J?#2.62 J?#2.68 J?#2.74 J?#2.80 J?#3.85 J?#3.107 J?#3.113 J?#3.119 J?#3.125 J?#3.129 J?#3.135 J?#3.141 J?#3.147 J?#3.153 J?#3.159 J?#4.86 J?#4.102 J?#4.132 J?#4.138 J?#4.144 J?#4.146 J?#4.152 J?#4.158 J?#5.165 J?#5.171 J?#5.177 J?#5.201 J?#5.231 J?#6.164 J?#6.170 J?#6.176 J?#6.200 J?#7.241 J?#7.243 J?#7.245 J?#7.247 J?#7.249 J?#7.261(MNT_1) J?#8.242 J?#8.244 J?#8.246 J?#8.248 J?#8.250 J?#8.262(MNT_2) J?#9.2 MP?#1.1 MP?#2.1 Q?#3.1(Source1) Q?#4.4(Source2) R?#7.2 R?#14.1 R?#15.1 R?#19.1 U?#1.3(GND) U?#2.3(GND) U?#3.1(GND)
JETSON_1V8_REF: C?#1.1 C?#2.1 C?#3.1 Q?#1.1(G) Q?#2.1(G) Q?#5.1(G) Q?#6.1(G) Q?#7.1(G) Q?#8.1(G) Q?#9.1(G) R?#1.2 R?#4.2 R?#17.2 R?#18.2 R?#20.2 R?#21.2 R?#24.2 R?#27.2 R?#30.2 R?#33.2 U?#1.5(VCC) U?#2.5(VCC) U?#3.2(VOUT) U?#3.4(VOUT)
1V8_CAM0_PWDN: J?#4.114 R?#12.1
1V8_CAM1_PWDN: J?#4.120 R?#13.1
1V8_SMB_nALERT: R?#18.1 U?#2.2(A) ; port SMB_nALERT
1V8_SPI1_MISO: D?#13.4(IO3) D?#13.7(NC) J?#4.108 Q?#7.2(S) R?#27.1
1V8_SPI1_MOSI: D?#13.1(IO1) D?#13.10(NC) J?#4.104 Q?#5.2(S) R?#21.1
1V8_SPI1_nCS_0: D?#13.5(IO4) D?#13.6(NC) J?#4.110 Q?#8.2(S) R?#30.1
1V8_SPI1_nCS_1: J?#4.112 Q?#9.2(S) R?#33.1
1V8_SPI1_SCLK: D?#13.2(IO2) D?#13.9(NC) J?#4.106 Q?#6.2(S) R?#24.1
CAM0_PWDN: Q?#3.6(Drain1) ; port CAM0_PWDN
CAM1_PWDN: Q?#4.3(Drain2) ; port CAM1_PWDN
CAM_I2C_SCL: D?#10.4(IO3) D?#10.7(NC) J?#5.213 ; port CAM_I2C_SCL
CAM_I2C_SDA: D?#10.5(IO4) D?#10.6(NC) J?#5.215 ; port CAM_I2C_SDA
CAN_RX: D?#19.1(IO1) D?#19.10(NC) J?#3.143 ; port CAN_RX
CAN_TX: D?#19.2(IO2) D?#19.9(NC) J?#3.145 ; port CAN_TX
CSI0_CLK_N: D?#2.2(IO2) D?#2.9(NC) J?#2.10 ; port CSI0_CLK_N
CSI0_CLK_P: D?#2.1(IO1) D?#2.10(NC) J?#2.12 ; port CSI0_CLK_P
CSI0_D0_N: D?#2.5(IO4) D?#2.6(NC) J?#2.4 ; port CSI0_D0_N
CSI0_D0_P: D?#2.4(IO3) D?#2.7(NC) J?#2.6 ; port CSI0_D0_P
CSI0_D1_N: R?#8.2 ; port CSI0_D1_N
CSI0_D1_P: R?#9.2 ; port CSI0_D1_P
CSI1_D0_N: R?#10.2 ; port CSI1_D0_N
CSI1_D0_P: R?#11.2 ; port CSI1_D0_P
CSI1_D1_N: D?#3.4(IO3) D?#3.7(NC) J?#1.15 ; port CSI1_D1_N
CSI1_D1_P: D?#3.5(IO4) D?#3.6(NC) J?#1.17 ; port CSI1_D1_P
CSI2_CLK_N: D?#11.1(IO1) D?#11.10(NC) J?#2.28 ; port CSI2_CLK_N
CSI2_CLK_P: D?#11.2(IO2) D?#11.9(NC) J?#2.30 ; port CSI2_CLK_P
CSI2_D0_N: D?#7.4(IO3) D?#7.7(NC) J?#2.22 ; port CSI2_D0_N
CSI2_D0_P: D?#7.5(IO4) D?#7.6(NC) J?#2.24 ; port CSI2_D0_P
CSI2_D1_N: D?#11.4(IO3) D?#11.7(NC) J?#2.34 ; port CSI2_D1_N
CSI2_D1_P: D?#11.5(IO4) D?#11.6(NC) J?#2.36 ; port CSI2_D1_P
CSI3_D0_N: D?#8.1(IO1) D?#8.10(NC) J?#1.21 ; port CSI3_D0_N
CSI3_D0_P: D?#8.2(IO2) D?#8.9(NC) J?#1.23 ; port CSI3_D0_P
CSI3_D1_N: D?#8.4(IO3) D?#8.7(NC) J?#1.33 ; port CSI3_D1_N
CSI3_D1_P: D?#8.5(IO4) D?#8.6(NC) J?#1.35 ; port CSI3_D1_P
DEBUG_RXD: R?#3.2 ; port DEBUG_RXD
DEBUG_TXD: R?#6.2 ; port DEBUG_TXD
DP1_AUX_N: D?#12.4(IO3) D?#12.7(NC) J?#4.98 ; port DP1_AUX_N
DP1_AUX_P: D?#12.5(IO4) D?#12.6(NC) J?#4.100 ; port DP1_AUX_P
DP1_HPD: D?#12.2(IO2) D?#12.9(NC) J?#4.96 ; port DP1_HPD
DP1_TXD0_N: D?#4.1(IO1) D?#4.10(NC) J?#1.63 ; port DP1_TXD0_N
DP1_TXD0_P: D?#4.2(IO2) D?#4.9(NC) J?#1.65 ; port DP1_TXD0_P
DP1_TXD1_N: D?#4.4(IO3) D?#4.7(NC) J?#1.69 ; port DP1_TXD1_N
DP1_TXD1_P: D?#4.5(IO4) D?#4.6(NC) J?#1.71 ; port DP1_TXD1_P
DP1_TXD2_N: D?#9.1(IO1) D?#9.10(NC) J?#1.75 ; port DP1_TXD2_N
DP1_TXD2_P: D?#9.2(IO2) D?#9.9(NC) J?#1.77 ; port DP1_TXD2_P
DP1_TXD3_N: D?#9.4(IO3) D?#9.7(NC) J?#3.81 ; port DP1_TXD3_N
DP1_TXD3_P: D?#9.5(IO4) D?#9.6(NC) J?#3.83 ; port DP1_TXD3_P
DP_HDMI_CEC: D?#12.1(IO1) D?#12.10(NC) J?#4.94 ; port DP_HDMI_CEC
GBE_LED_ACT: J?#6.194 ; port GBE_LED_ACT
GBE_LED_LINK: J?#6.188 ; port GBE_LED_LINK
GBE_MDI0_N: D?#1.1(IO1) D?#1.10(NC) J?#6.184 ; port GBE_MDI0_N
GBE_MDI0_P: D?#1.2(IO2) D?#1.9(NC) J?#6.186 ; port GBE_MDI0_P
GBE_MDI1_N: D?#1.4(IO3) D?#1.7(NC) J?#6.190 ; port GBE_MD1_N
GBE_MDI1_P: D?#1.5(IO4) D?#1.6(NC) J?#6.192 ; port GBE_MD1_P
GBE_MDI2_N: D?#6.1(IO1) D?#6.10(NC) J?#6.196 ; port GBE_MDI2_N
GBE_MDI2_P: D?#6.2(IO2) D?#6.9(NC) J?#6.198 ; port GBE_MDI2_P
GBE_MDI3_N: D?#6.4(IO3) D?#6.7(NC) J?#6.202 ; port GBE_MDI3_N
GBE_MDI3_P: D?#6.5(IO4) D?#6.6(NC) J?#6.204 ; port GBE_MDI3_P
GPIO08_FAN_TACH: J?#6.208 ; port GPIO08_FAN_TACH
GPIO10_nSMB_ALERT: J?#6.212 R?#17.1 U?#2.4(Y)
GPIO14_FAN_PWM: J?#6.230 ; port GPIO14_FAN_CTRL
GPIO_01: J?#4.118
GPIO_02: J?#4.124
GPIO_03: J?#4.126
GPIO_04: J?#3.127
GPIO_05: J?#4.128
GPIO_06: J?#4.130
GPIO_07: J?#6.206
GPIO_09: J?#5.211
GPIO_11: J?#6.216
GPIO_12: J?#6.218
GPIO_13: J?#6.228
I2C0_SCL: D?#14.4(IO3) D?#14.7(NC) J?#5.185 ; port I2C0_SCL
I2C0_SDA: D?#14.5(IO4) D?#14.6(NC) J?#5.187 ; port I2C0_SDA
I2C1_SCL: J?#5.189 ; port SMB_CLK
I2C1_SDA: J?#5.191 ; port SMB_DATA
I2S0_DIN: D?#18.2(IO2) D?#18.9(NC) J?#5.195 TP?#1.1(TP)
I2S0_DOUT: D?#18.1(IO1) D?#18.10(NC) J?#5.193 TP?#2.1(TP) ; port I2S0_DOUT
I2S0_FS: D?#18.4(IO3) D?#18.7(NC) J?#5.197 TP?#4.1(TP) ; port I2S0_FS
I2S0_SCLK: D?#18.5(IO4) D?#18.6(NC) J?#5.199 TP?#5.1(TP) ; port I2S0_SCLK
MODULE_ID: J?#5.217 R?#7.1
nFORCE_RECOVERY: J?#6.214 J?#9.1 R?#20.1 ; port nFORCE_RECOVERY
nMOD_SLEEP: J?#6.178 ; port nMOD_SLEEP
nSHUTDOWN_REQ: J?#5.233 ; port nSHUTDOWN_REQ
nSYS_RESET: J?#5.239 ; port nSYS_RESET
PCIE0_CLK_N: D?#21.1(IO1) D?#21.10(NC) J?#4.160 ; port PCIE0_CLK_N
PCIE0_CLK_P: D?#21.2(IO2) D?#21.9(NC) J?#6.162 ; port PCIE0_CLK_P
PCIE0_nCLKREQ: J?#6.180 ; port PCIE0_nCLKREQ
PCIE0_nRST: D?#14.2(IO2) D?#14.9(NC) J?#5.181 ; port PCIE0_nRST
PCIE0_RX0_N: D?#15.1(IO1) D?#15.10(NC) J?#3.131 ; port PCIE0_RX0_N
PCIE0_RX0_P: D?#15.2(IO2) D?#15.9(NC) J?#3.133 ; port PCIE0_RX0_P
PCIE0_RX1_N: D?#15.4(IO3) D?#15.7(NC) J?#3.137 ; port PCIE0_RX1_N
PCIE0_RX1_P: D?#15.5(IO4) D?#15.6(NC) J?#3.139 ; port PCIE0_RX1_P
PCIE0_RX2_N: D?#19.4(IO3) D?#19.7(NC) J?#3.149 ; port PCIE0_RX2_N
PCIE0_RX2_P: D?#19.5(IO4) D?#19.6(NC) J?#3.151 ; port PCIE0_RX2_P
PCIE0_RX3_N: D?#20.1(IO1) D?#20.10(NC) J?#3.155 ; port PCIE0_RX3_N
PCIE0_RX3_P: D?#20.2(IO2) D?#20.9(NC) J?#3.157 ; port PCIE0_RX3_P
PCIE0_TX0_N: D?#17.1(IO1) D?#17.10(NC) J?#4.134 ; port PCIE0_TX0_N
PCIE0_TX0_P: D?#17.2(IO2) D?#17.9(NC) J?#4.136 ; port PCIE0_TX0_P
PCIE0_TX1_N: D?#17.4(IO3) D?#17.7(NC) J?#4.140 ; port PCIE0_TX1_N
PCIE0_TX1_P: D?#17.5(IO4) D?#17.6(NC) J?#4.142 ; port PCIE0_TX1_P
PCIE0_TX2_N: D?#16.1(IO1) D?#16.10(NC) J?#4.148 ; port PCIE0_TX2_N
PCIE0_TX2_P: D?#16.2(IO2) D?#16.9(NC) J?#4.150 ; port PCIE0_TX2_P
PCIE0_TX3_N: D?#16.4(IO3) D?#16.7(NC) J?#4.154 ; port PCIE0_TX3_N
PCIE0_TX3_P: D?#16.5(IO4) D?#16.6(NC) J?#4.156 ; port PCIE0_TX3_P
PCIE_32K_CLK: R?#16.1 U?#1.4(Y) ; port PCIE_32K_CLK
PCIE_WAKE: D?#14.1(IO1) D?#14.10(NC) J?#5.179 ; port PCIE_WAKE
PMIC_BBAT: J?#5.235 TP?#3.1(TP)
POWER_EN: J?#5.237 ; port POWER_EN
PRE_CSI0_D1_N: D?#7.1(IO1) D?#7.10(NC) J?#2.16 R?#8.1
PRE_CSI0_D1_P: D?#7.2(IO2) D?#7.9(NC) J?#2.18 R?#9.1
PRE_CSI1_D0_N: D?#3.1(IO1) D?#3.10(NC) J?#1.3 R?#10.1
PRE_CSI1_D0_P: D?#3.2(IO2) D?#3.9(NC) J?#1.5 R?#11.1
PRE_PCIE_32K_CLK: J?#6.210 U?#1.2(A)
SLEEP/nWAKE: J?#6.240 R?#19.2 ; port SLEEP/nWAKE
SPI1_MISO: R?#29.2 ; port SPI1_MISO
SPI1_MOSI: R?#23.2 ; port SPI1_MOSI
SPI1_nCS_0: R?#32.2 ; port SPI1_nCS_0
SPI1_nCS_1: R?#35.2 ; port SPI1_nCS_1
SPI1_SCLK: R?#26.2 ; port SPI1_SCLK
UART2_RXD: J?#6.238 Q?#1.2(S) R?#1.1
UART2_TXD: J?#6.236 Q?#2.2(S) R?#4.1
USB0_D_N: D?#5.1(IO1) D?#5.10(NC) J?#3.109 ; port USB0_D_N
USB0_D_P: D?#5.2(IO2) D?#5.9(NC) J?#3.111 ; port USB0_D_P
USB1_D_N: D?#5.4(IO3) D?#5.7(NC) J?#3.115 ; port USB1_D_N
USB1_D_P: D?#5.5(IO4) D?#5.6(NC) J?#3.117 ; port USB1_D_P
USBSS0_RX_N: D?#20.4(IO3) D?#20.7(NC) J?#5.161 ; port USBSS0_RX_N
USBSS0_RX_P: D?#20.5(IO4) D?#20.6(NC) J?#5.163 ; port USBSS0_RX_P
USBSS0_TX_N: D?#21.4(IO3) D?#21.7(NC) J?#6.166 ; port USBSS0_TX_N
USBSS0_TX_P: D?#21.5(IO4) D?#21.6(NC) J?#6.168 ; port USBSS0_TX_P
VBUS_DETECT: J?#3.87 ; port VBUS_DETECT
NetQ?#1_3: Q?#1.3(D) R?#2.1 R?#3.1
NetQ?#2_3: Q?#2.3(D) R?#5.1 R?#6.1
NetQ?#3_2: Q?#3.2(Gate1) R?#12.2 R?#14.2
NetQ?#4_5: Q?#4.5(Gate2) R?#13.2 R?#15.2
NetQ?#5_3: Q?#5.3(D) R?#22.1 R?#23.1
NetQ?#6_3: Q?#6.3(D) R?#25.1 R?#26.1
NetQ?#7_3: Q?#7.3(D) R?#28.1 R?#29.1
NetQ?#8_3: Q?#8.3(D) R?#31.1 R?#32.1
NetQ?#9_3: Q?#9.3(D) R?#34.1 R?#35.1

Not connected (* = marked no-connect by the designer): D?#10 1(IO1) 2(IO2) 9(NC) 10(NC); J?#1 9* 11* 27* 29* 39* 41* 45* 47* 51* 53* 57* 59*; J?#2 40* 42* 46* 48* 52* 54* 58* 60* 64* 66* 70* 72* 76* 78*; J?#3 89* 91* 93* 95* 97* 99* 101* 103* 105* 121* 123*; J?#4 82* 84* 88* 90* 92* 116* 122*; J?#5 167* 169* 173* 175* 183* 203* 205* 207* 209* 219* 221* 223* 225* 227* 229*; J?#6 172* 174* 182* 220* 222* 224* 226* 232* 234*; U?#1 1(NC)*; U?#2 1(NC)*

## Layout directives
net class 85DIFF: PCIE0_CLK_N, PCIE0_CLK_P, PCIE0_RX0_N, PCIE0_RX0_P, PCIE0_RX1_N, PCIE0_RX1_P, PCIE0_RX2_N, PCIE0_RX2_P, PCIE0_RX3_N, PCIE0_RX3_P, PCIE0_TX0_N, PCIE0_TX0_P, PCIE0_TX1_N, PCIE0_TX1_P, PCIE0_TX2_N, PCIE0_TX2_P, PCIE0_TX3_N, PCIE0_TX3_P, USBSS0_RX_N, USBSS0_RX_P, USBSS0_TX_N, USBSS0_TX_P
net class 90DIFF: USB0_D_N, USB0_D_P, USB1_D_N, USB1_D_P
differential pair; differential pair class 85DIFF: PCIE0_CLK_N, PCIE0_CLK_P, PCIE0_RX0_N, PCIE0_RX0_P, PCIE0_RX1_N, PCIE0_RX1_P, PCIE0_RX2_N, PCIE0_RX2_P, PCIE0_RX3_N, PCIE0_RX3_P, PCIE0_TX0_N, PCIE0_TX0_P, PCIE0_TX1_N, PCIE0_TX1_P, PCIE0_TX2_N, PCIE0_TX2_P, PCIE0_TX3_N, PCIE0_TX3_P, USBSS0_RX_N, USBSS0_RX_P, USBSS0_TX_N, USBSS0_TX_P
differential pair; differential pair class 90DIFF: USB0_D_N, USB0_D_P, USB1_D_N, USB1_D_P
net class 100DIFF: CSI0_CLK_N, CSI0_CLK_P, CSI0_D0_N, CSI0_D0_P, CSI0_D1_N, CSI0_D1_P, CSI1_D0_N, CSI1_D0_P, CSI1_D1_N, CSI1_D1_P, CSI2_CLK_N, CSI2_CLK_P, CSI2_D0_N, CSI2_D0_P, CSI2_D1_N, CSI2_D1_P, CSI3_D0_N, CSI3_D0_P, CSI3_D1_N, CSI3_D1_P, DP1_TXD0_N, DP1_TXD0_P, DP1_TXD1_N, DP1_TXD1_P, DP1_TXD2_N, DP1_TXD2_P, DP1_TXD3_N, DP1_TXD3_P, GBE_MDI0_N, GBE_MDI0_P, GBE_MDI1_N, GBE_MDI1_P, GBE_MDI2_N, GBE_MDI2_P, GBE_MDI3_N, GBE_MDI3_P, PRE_CSI0_D1_N, PRE_CSI0_D1_P, PRE_CSI1_D0_N, PRE_CSI1_D0_P
differential pair; differential pair class 100DIFF: DP1_TXD0_N, DP1_TXD0_P, DP1_TXD1_N, DP1_TXD1_P, DP1_TXD2_N, DP1_TXD2_P, DP1_TXD3_N, DP1_TXD3_P, GBE_MDI0_N, GBE_MDI0_P, GBE_MDI1_N, GBE_MDI1_P, GBE_MDI2_N, GBE_MDI2_P, GBE_MDI3_N, GBE_MDI3_P, PRE_CSI0_D1_N, PRE_CSI0_D1_P, PRE_CSI1_D0_N, PRE_CSI1_D0_P
differential pair: DP1_AUX_N, DP1_AUX_P

## Notes on the sheet
- SODIMM CONNECTOR
- DEBUG USB + UART
- FIGURE 10-1 OF ORIN SERIES DESIGN GUIDE, POLARITY OF SOME CSI LANES IS SWAPPED ON SoC
- JUMPERS ON USBSS0 IN CASE WE WANT CAPS
- USB3_0
- ETH_0
- (near Q?#1) GATE V_TH OK
- SPI0
- UART0
- USB2_1
- (near Q?#2) GATE V_TH OK
- CAM0_MCLK
- CAM1_MCLK
- USB2_2
- UART1
- CSI_0-3
- (near R?#8) JUMPERS HERE SINCE POLARITY SWAPPED ON ORIN
- ESD PROTECTED PINS
- (near R?#7) MODULE_ID
- - I2C2 IS 1.8V DO NOT USE
  - POWER ON SEQUENCE IS IN SECTION 3 OF DATASHEET --> CARRIER BOARD MANAGES POWER, NOT JETSON
  - SPI IS 1V8 CMOS LOGIC
- SDMMC1
- I2S1
- (near MP?#1) Standoffs
- I2C2
- UART2 --> DEBUG
- nSYS_RESET indicates when carrier can power on
- PCIE_0 (4x)
- ESD PROTECTION
- (near U?#1) 32K_CLK_BUFF
- ETH ESD
- CSI ESD
- HDMI ESD
- USB ESD
- PCIE SUSPEND CLOCK BUFFER
- (near U?#2) SMB_nALERT BUFF
- PORT CHECKLIST
- BUFFER FOR SMB_ALERT BASED ON ORIN
- CAM I2C ESD
- NO JUMP HERE SINCE JUMP IN NVME SCHEM
- HDMI
- I2C_0-1
- PCIe and USBSS ESD
- SPI ESD
- MISC ESD
- CAN
- GPIO
- (near R?#19) PULLED DOWN SINCE ACTIVE LOW TO WAKE MODULE
  WON'T USE SLEEP/nWAKE BUT CONNECT TO STM AND EXPOSE
- POWER
- I2S_0
- LOOK INTO PUTTING JETSON TO SLEEP FOR SENTRY MODE ETC.
- (near Q?#5) GATE V_TH OK
- 1V8 REF LDO
- (near Q?#6) GATE V_TH OK
- SPI_1
- (near Q?#7) GATE V_TH OK
- (near U?#3) https://developer.download.nvidia.com/assets/embedded/secure/jetson/orin_nx/docs/Jetson-Orin-NX-Series-Modules-Data-Sheet_DS-10712-001_v1.1.pdf?qhjqqJOfVnHCM-1XF3yIQpd2xfOOHwmcgVwMEoYJ7MxLV6htvBcCQBAWi_BDO8yBEWslRcUaReucjDkH91McAghWwJmYjhTJoVoEUvLFgX583-qKr_REPRGUalLshQ-DeOK5XvySH5OmW4RDnQayRqIhzIBBSUWPjFaWLdJjM1JhWiyI3hM5VtWcQCIuw7hGP4sJ7ZLCMgQXeMz6eFhUxr5xiOQPPyQ1&t=eyJscyI6ImdzZW8iLCJsc2QiOiJodHRwczovL3d3dy5nb29nbGUuY29tLyJ9
- https://developer.download.nvidia.com/assets/embedded/secure/jetson/orin_nano/docs/Jetson-Orin-Nano-Series-Modules-Data-Sheet_DS-11105-001_v1.2.pdf?jdQi_j839Sjggjj5QTF3_oOgnPN2J2ewz7Km2q-aLyRAS0YMswcsS8demvG6kdssXTo3By--j94fp-O5W54ShkpP0OL6Z16cXsATsCs5kVxLQzyDWp4PJJSuB9S5pyMOEFmtw_tlPL_Gy2oPuhK_UbNdkrgh1dCA55zEuK928asFQhAHapZ0s__KiE7erU3EBWJIZ94vBC5BwytStbskK9hDtogPdFhuGCQNTg==&t=eyJscyI6ImdzZW8iLCJsc2QiOiJodHRwczovL3d3dy5nb29nbGUuY29tLyJ9
- https://resources.altium.com/p/gigabit-ethernet-101-basics-implementation
- LDO SHOULD BE OFF UNTIL JETSON BOOTS
- (near Q?#8) GATE V_TH OK
- Is there any reason ever to not use nmos level shifters?
  Current LDOs have 1V drop so my 2V_AUX reg needs to have a higher voltage. Do you know any dropin replacements that don't break the bank and have less drop? Currently have LD1117
- https://www.congatec.com/fileadmin/user_upload/Documents/Application_Notes/AN43_M.2_Pinout_Descriptions_and_Reference_Designs.pdf
- Jetson reference manual
- https://developer.download.nvidia.com/assets/embedded/secure/jetson/orin_nx/docs/DG-10931-001_v1.2.pdf?a9ej-2Bw8ItDc1cnJp_Orjmj0ruhafQwJG7pHYeyXv2gwzFspQ0ZbPaHE0IwtPv6h2NAYJaZXDoFolUZ5Iw8vU13fA-kLmHK94KlPsyvaeFIbWePzp1X10HDT7HvJCgNl1WkV_8WJp9-smZyxlSW_wKeuMdy5xgzu_0wxoi4gg==&t=eyJscyI6ImdzZW8iLCJsc2QiOiJodHRwczovL3d3dy5nb29nbGUuY29tLyJ9
- (near Q?#9) GATE V_TH OK

## Library data of the parts
C?#1 C?#2 = CMP-001-00058-1: LARGE PADS, 0402 CAP, CHANGE COMMENT TO MATCH REAL P/N; Capacitor Type: Ceramic; Min Operating Temperature: -55°C; Mounting Technology: Surface Mount; Pins: 2; Case/Package: 0402; RoHS Compliant: Yes; Max Operating Temperature: 85°C
C?#3 = CMP-2006-02792-2: Chip Multilayer Ceramic Capacitors for General Purpose, 0603, 10uF, X5R, 15%, 20%, 6.3V; Packaging: Tape and Reel; Voltage Rating (DC): 6.3V; Width: 0.031inch; Termination: SMD/SMT; Dielectric: X5R; Package Quantity: 4000; Voltage Rating: 6.3V; Capacitance: 10uF; Case/Package: 0603; Min Operating Temperature: -55°C; Voltage: 6.3V; Length: 1.6mm; Thickness: 0.035inch; Lead Free: Lead Free; Depth: 0.8mm; Case Code (Imperial): 0603; Max Operating Temperature: 85°C; Material: Ceramic; Height: 0.8mm; Tolerance: 20%; Mount: Surface Mount; REACH SVHC: No SVHC; Radiation Hardening: No; Case Code (Metric): 1608
C?#4 = CMP-2000-05393-2: Multilayer Ceramic Capacitors 100nF ±10% 50V X7R SMD 0402; Voltage: 50V; Dielectric Material: Ceramic; Min Operating Temperature: -55°C; Depth: 0.5mm; Radiation Hardening: No; RoHS Compliant: Yes; Voltage Rating (DC): 50V; Lead Free: Lead Free; Resistor Type: Ceramic; Height: 0.5mm; Dielectric: X7R; Thickness: 0.022inch; Case/Package: 0402; Case Code (Metric): 1005; Termination: SMD/SMT; Capacitance: 100nF; Packaging: Tape and Reel; Max Operating Temperature: 125°C; Mount: Surface Mount; Package Quantity: 1; Width: 0.02inch; Weight: 2.3E-05oz; Voltage Rating: 50V; Tolerance: 10%; Construction: Flat; Case Code (Imperial): 0402; Length: 1mm; REACH SVHC: No SVHC; Series: C
D?#1-D?#21 = CMP-04989-000002-1: 4-CHANNEL LOW-CAPACITANCE SURGE; Manufacturer: Texas Instruments; Value: 0.55pF; Reverse Standoff Voltage: 3.6V; Standoff Height: 0mm; Breakdown Voltage: 5.5V; Peak Pulse Current: 5.5A; Clamping Voltage: 11.5V; Direction: Bidirectional; Peak Pulse Power: 50W; Number Of Channels: 4; Ambient Temperature Range High: +125°C; ComponentLink2Description: Datasheet; Height: 0.55mm; Lead Free: Yes; Device Class L3: unset; Temperature Range High: +125°C; Temperature Range Low: -40°C; Package: DQA0010A; Temperature: -40°C to +125°C; Capacitance: 0.55pF; RoHS: TRUE; Mouser Description: 4-Channel Low-Capacitance Surge and ESD Protection Diode 10-USON -40 to 125; Category: Diode; Device Class L1: Circuit Protection; Octopart: https://octopart.com/esd204dqar-texas+instruments-89917476; Device Class L2: TVS Diodes; Ambient Temperature Range Low: -40°C; Manufacturer Part Number: ESD204DQAR; ComponentLink2URL: http://www.ti.com/lit/ds/symlink/esd204.pdf; Automotive: No; Digikey Description: 4-CHANNEL LOW-CAPACITANCE SURGE
J?#1-J?#8 = CMP-03356-000001-1: DDR4 SODIMM 260P 9.2H STD; Manufacturer: TE Connectivity; Voltage Rating: 25V; Current Rating: 0.5A; Is Female: yes; Pitch: 0.5mm; Memory Type: SDRAM,DDR; Conn Orientation: Horizontal; Number Of Contacts: 260; Temperature: -55°C to +85°C; Octopart: https://octopart.com/2309413-1-te+connectivity-84799194; Device Class L3: unset; Contact Material: Gold,Nickel; ComponentLink2URL: https://www.te.com/commerce/DocumentDelivery/DDEController?Action=showdoc&DocId=Specification+Or+Standard%7F108-115122%7FA1%7Fpdf%7FEnglish%7FENG_SS_108-115122_A1.pdf%7F2309413-1; Manufacturer Part Number: 2309413-1; ComponentLink2Description: Datasheet; Digikey Description: DDR4 SODIMM 260P 9.2H STD; Height: 18.8mm; Footprint Url: https://www.te.com/commerce/DocumentDelivery/DDEController?Action=showdoc&DocId=Customer+Drawing%7F2309413%7F4%7Fpdf%7FEnglish%7FENG_CD_2309413_4.pdf%7F2309413-1; Temperature Range Low: -55°C; Device Class L2: Memory Connectors; Temperature Range High: +85°C; RoHS: TRUE; Automotive: No; Device Class L1: Connectors; Mouser Description: Conn DDR4 DIMM Socket SKT 260 POS 0.5mm Solder RA SMD T/R; Category: Conn; Package: 0; Lead Free: Yes
J?#9 = CMP-02766-001428-1: CONN HEADER VERT 2POS 2.54MM; Voltage Rating: 550V; Current Rating: 7.6A; Gender: Male; Number of Contacts: 2; Connector Type: Male Pin; Radiation Hardening: No; Orientation: Straight; Contact Plating: Gold; Max Operating Temperature: 125°C; Mount: Through Hole; Package Quantity: 1; Number of Rows: 1; Housing Material: Polyester; RoHS Compliant: Yes; Length: 5.08mm; Max Voltage Rating (AC): 550V; Pitch: 2.54mm; Packaging: Bulk; Depth: 2.54mm; Termination: Solder; Min Operating Temperature: -55°C; Housing Color: Black; Lead Free: Lead Free; Color: Black; Number of Positions: 2; Width: 2.54mm; Max Current Rating: 7.6A; REACH SVHC: No SVHC; Contact Material: Bronze; Contact Mating Length: 0.23inch; Series: TSW; Contact Type: Male Pin
MP?#1 MP?#2 = CMP-03913-59774857-1: 9774025243R Spacer Material: Steel, Tin-Plated Mounting: SMT Series: WA-SMST Thread D: M2; Outside Diameter: 4.3434mm; Threaded/Unthreaded: Threaded; Plating: Tin; REACH SVHC: Unknown; NexarPartId: 59774857; RoHS: Compliant; Material: Steel; Packaging: Tape and Reel; Max Operating Temperature: 150°C; Min Operating Temperature: -55°C; Length: 2.5mm; Height: 2.5mm
Q?#1 Q?#2 Q?#5-Q?#9 = CMP-2000-05968-1: N-Channel Enhancement Mode Mosfet, 50 V, 200 mA, -55 to 150 degC, 6-Pin SOT-323, RoHS, Tape and Reel; Typical Turn-Off Delay Time: 20ns; Number of Channels: 1Channel; Type: EnhancementModeFieldEffectTransistor; Brand: DiodesIncorporated; Vds - Drain-Source Breakdown Voltage: 75V; Vgs - Gate-Source Voltage: 20V; Rds On - Drain-Source Resistance: 1.4Ohms; Transistor Type: 1N-Channel; Configuration: Single; Unit Weight: 0.000212oz; Pd - Power Dissipation: 200mW; Id - Continuous Drain Current: 200mA; Forward Transconductance - Min: 0.1S; Manufacturer URL: http://www.diodes.com/; Series: BSS138; Package Description: 3-Pin Small Outline Transistor, Body 2 x 1.25 mm, Pitch 0.65 mm; Mounting Technology: SurfaceMount; Product Category: MOSFET; RoHS: True; Maximum Operating Temperature: +150C; Height: 1mm; Length: 2.2mm; Technology: Si; Width: 1.35mm; Datasheet URL: http://www.diodes.com/_files/datasheets/ds30206.pdf; Manufacturer: DiodesIncorporated; Package / Case: SOT-323-3; Typical Turn-On Delay Time: 20ns; Transistor Polarity: N-Channel; Factory Pack Quantity: 3000; Packaging: Reel; Product: MOSFETSmallSignal; Datasheet Version: Rev. 11-2, 09/2013; Package Reference: SOT323; Minimum Operating Temperature: -55C; Mounting Style: SMD/SMT; Channel Mode: Enhancement
Q?#3 Q?#4 = CMP-35916-000009-1: MOSFET 2N-CH 60V 0.3A; Input Capacitance: 40pF; Continuous Drain Current (ID): 300mA; Max Power Dissipation: 285mW; FET Type: 2 N-Channel; Rds On Max: 1.5R; Mount: Surface Mount; Drain to Source Voltage (Vdss): 60V; Packaging: Tape and Reel
R?#1 R?#2 R?#4 R?#5 R?#16-R?#18 R?#21 R?#22 R?#24 R?#25 R?#27 R?#28 R?#30 R?#31 R?#33 R?#34 = CMP-1012-00623-3: Chip Resistor, 10 KOhm, +/- 1%, 0.1 W, -55 to 155 degC, 0603 (1608 Metric), RoHS, Tape and Reel; Manufacturer: Panasonic; Voltage Rating: 75V; Case\/Package: 0603; Power Rating: 100mW; Resistance: 10KOhm; Temperature Coefficient: 100ppm\/degreesC; Number of Pins: 2; Package Reference: 603; Depth: 0.8mm; Mount: SurfaceMount; Package Description: 2-Pin Surface Mount Device, Body 1.6 x 0.85 mm; Datasheet Version: 02/2017; Length: 1.6mm; Lead Free: LeadFree; Height: 0.45mm; Number of Terminations: 2; Max Power Dissipation: 100mW; Min Operating Temperature: -55degC; Datasheet URL: https://industrial.panasonic.com/cdbs/www-data/pdf/RDA0000/AOA0000C304.pdf; Termination: SMD/SMT; Case Code (Metric): 1608; Case Code (Imperial): 0603; Tolerance: 1%; Max Operating Temperature: 155degC; RoHSCompliant: true; Voltage Rating (DC): 75V; Radiation Hardening: No; Packaging: TapeandReel; Composition: ThickFilm; Mounting Technology: SurfaceMount; Manufacturer URL: http://www.panasonic.com/; Width: 0.031inch; REACH SVHC: NoSVHC; Contact Plating: Tin; Military Standard: Not; Package Quantity: 1
R?#3 R?#6 R?#12 R?#13 R?#23 R?#26 R?#29 R?#32 R?#35 = CMP-2000-00180-1: Manufacturer: Panasonic; Part Number: ERJ-3EKF1001V
R?#7-R?#11 = CMP-009-00118-2: READ THE NAME; Pins: 2; Component Type: Standard; Design Item ID: CMP-009-00206-2; Source: 0402jump.SchLib
R?#14 R?#15 R?#19 R?#20 = CMP-2000-00182-1: Manufacturer: Panasonic; Part Number: ERJ-3EKF1003V
TP?#1-TP?#5 = CMP-00025-2: Test Point .6mm
U?#1 U?#2 = CMP-0859-00290-4: IC BUFF/DVR NON-INVERT SC70-5; Number of Output Lines: 1; Turn-On Delay Time: 8.3ns; Min Supply Voltage: 1.65V; Polarity: Non-Inverting; Quiescent Current: 10uA; Low Level Output Current: 32mA; Nominal Supply Current: 40mA; Logic Function: Buffer; Max Supply Voltage: 5.5V; Number of Bits: 1; Number of Circuits: 1; Contact Plating: Gold; Max Operating Temperature: 125°C; Package Quantity: 1; Number of Channels: 1; Number of Outputs: 1; Case/Package: SC; Number of Gates: 1; Number of Pins: 5; Radiation Hardening: No; Min Operating Temperature: -40°C; Number of Bits per Element: 1; Lead Free: Lead Free; High Level Output Current: 32mA; Number of Input Lines: 1; Number of Inputs: 1; Propagation Delay: 8.3ns; Number of Elements: 1; Packaging: Tape and Reel; Mount: Surface Mount; Termination: SMD/SMT; REACH SVHC: No SVHC
U?#3 = CMP-0244-00308-1: Fixed Low Drop Positive Voltage Regulator, 1.8V, 4-Pin SOT-223, Tape and Reel; ComponentLink1URL: http://www.st.com; PackageReference: SOT-223; PackageDescription: 4-Pin SOT-223 Package, 6.5 x 3.5 mm Body, 2.3 mm Pitch, 7 mm Lead Span; ComponentLink2URL: http://www.st.com/internet/com/TECHNICAL_RESOURCES/TECHNICAL_LITERATURE/DATASHEET/CD00000544.pdf; ComponentLink2Description: Datasheet; ComponentLink1Description: Manufacturer URL; DatasheetVersion: 1/11/2011; PackageVersion: 2010